# EasyEDA Pro project moss-controller-pcb.eprj, board PCB1
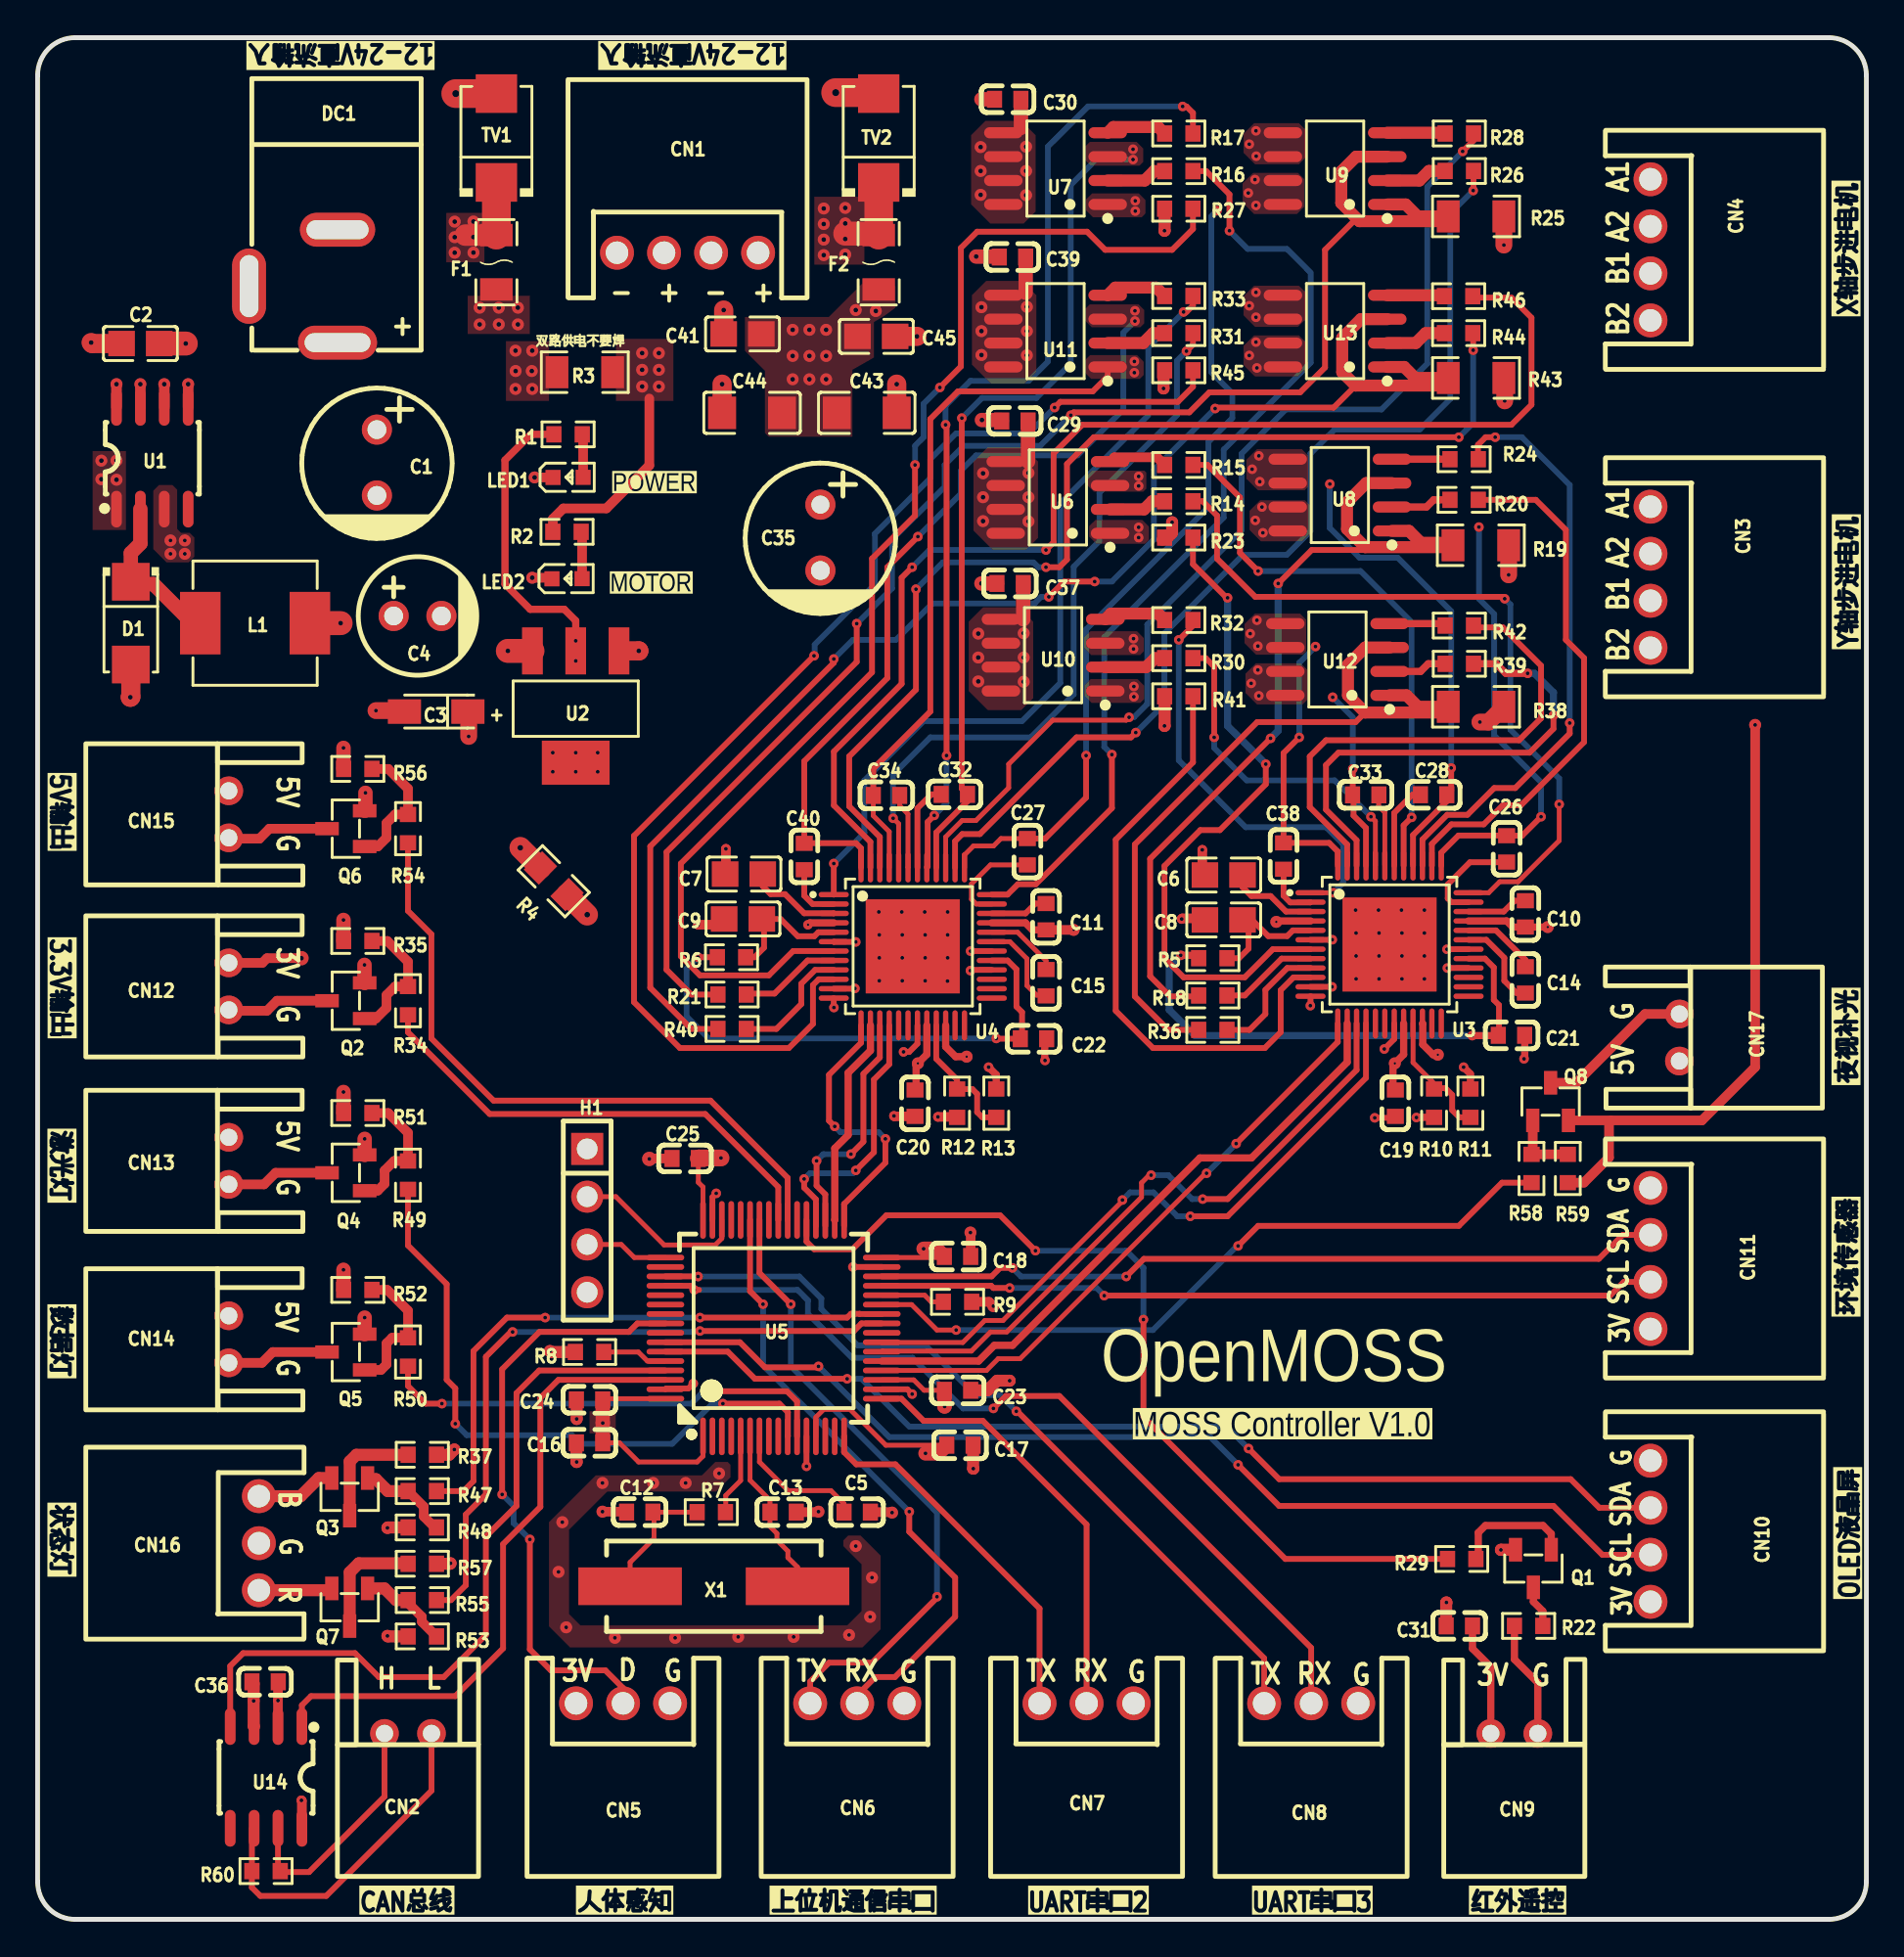
[diagram p2: board, top side]
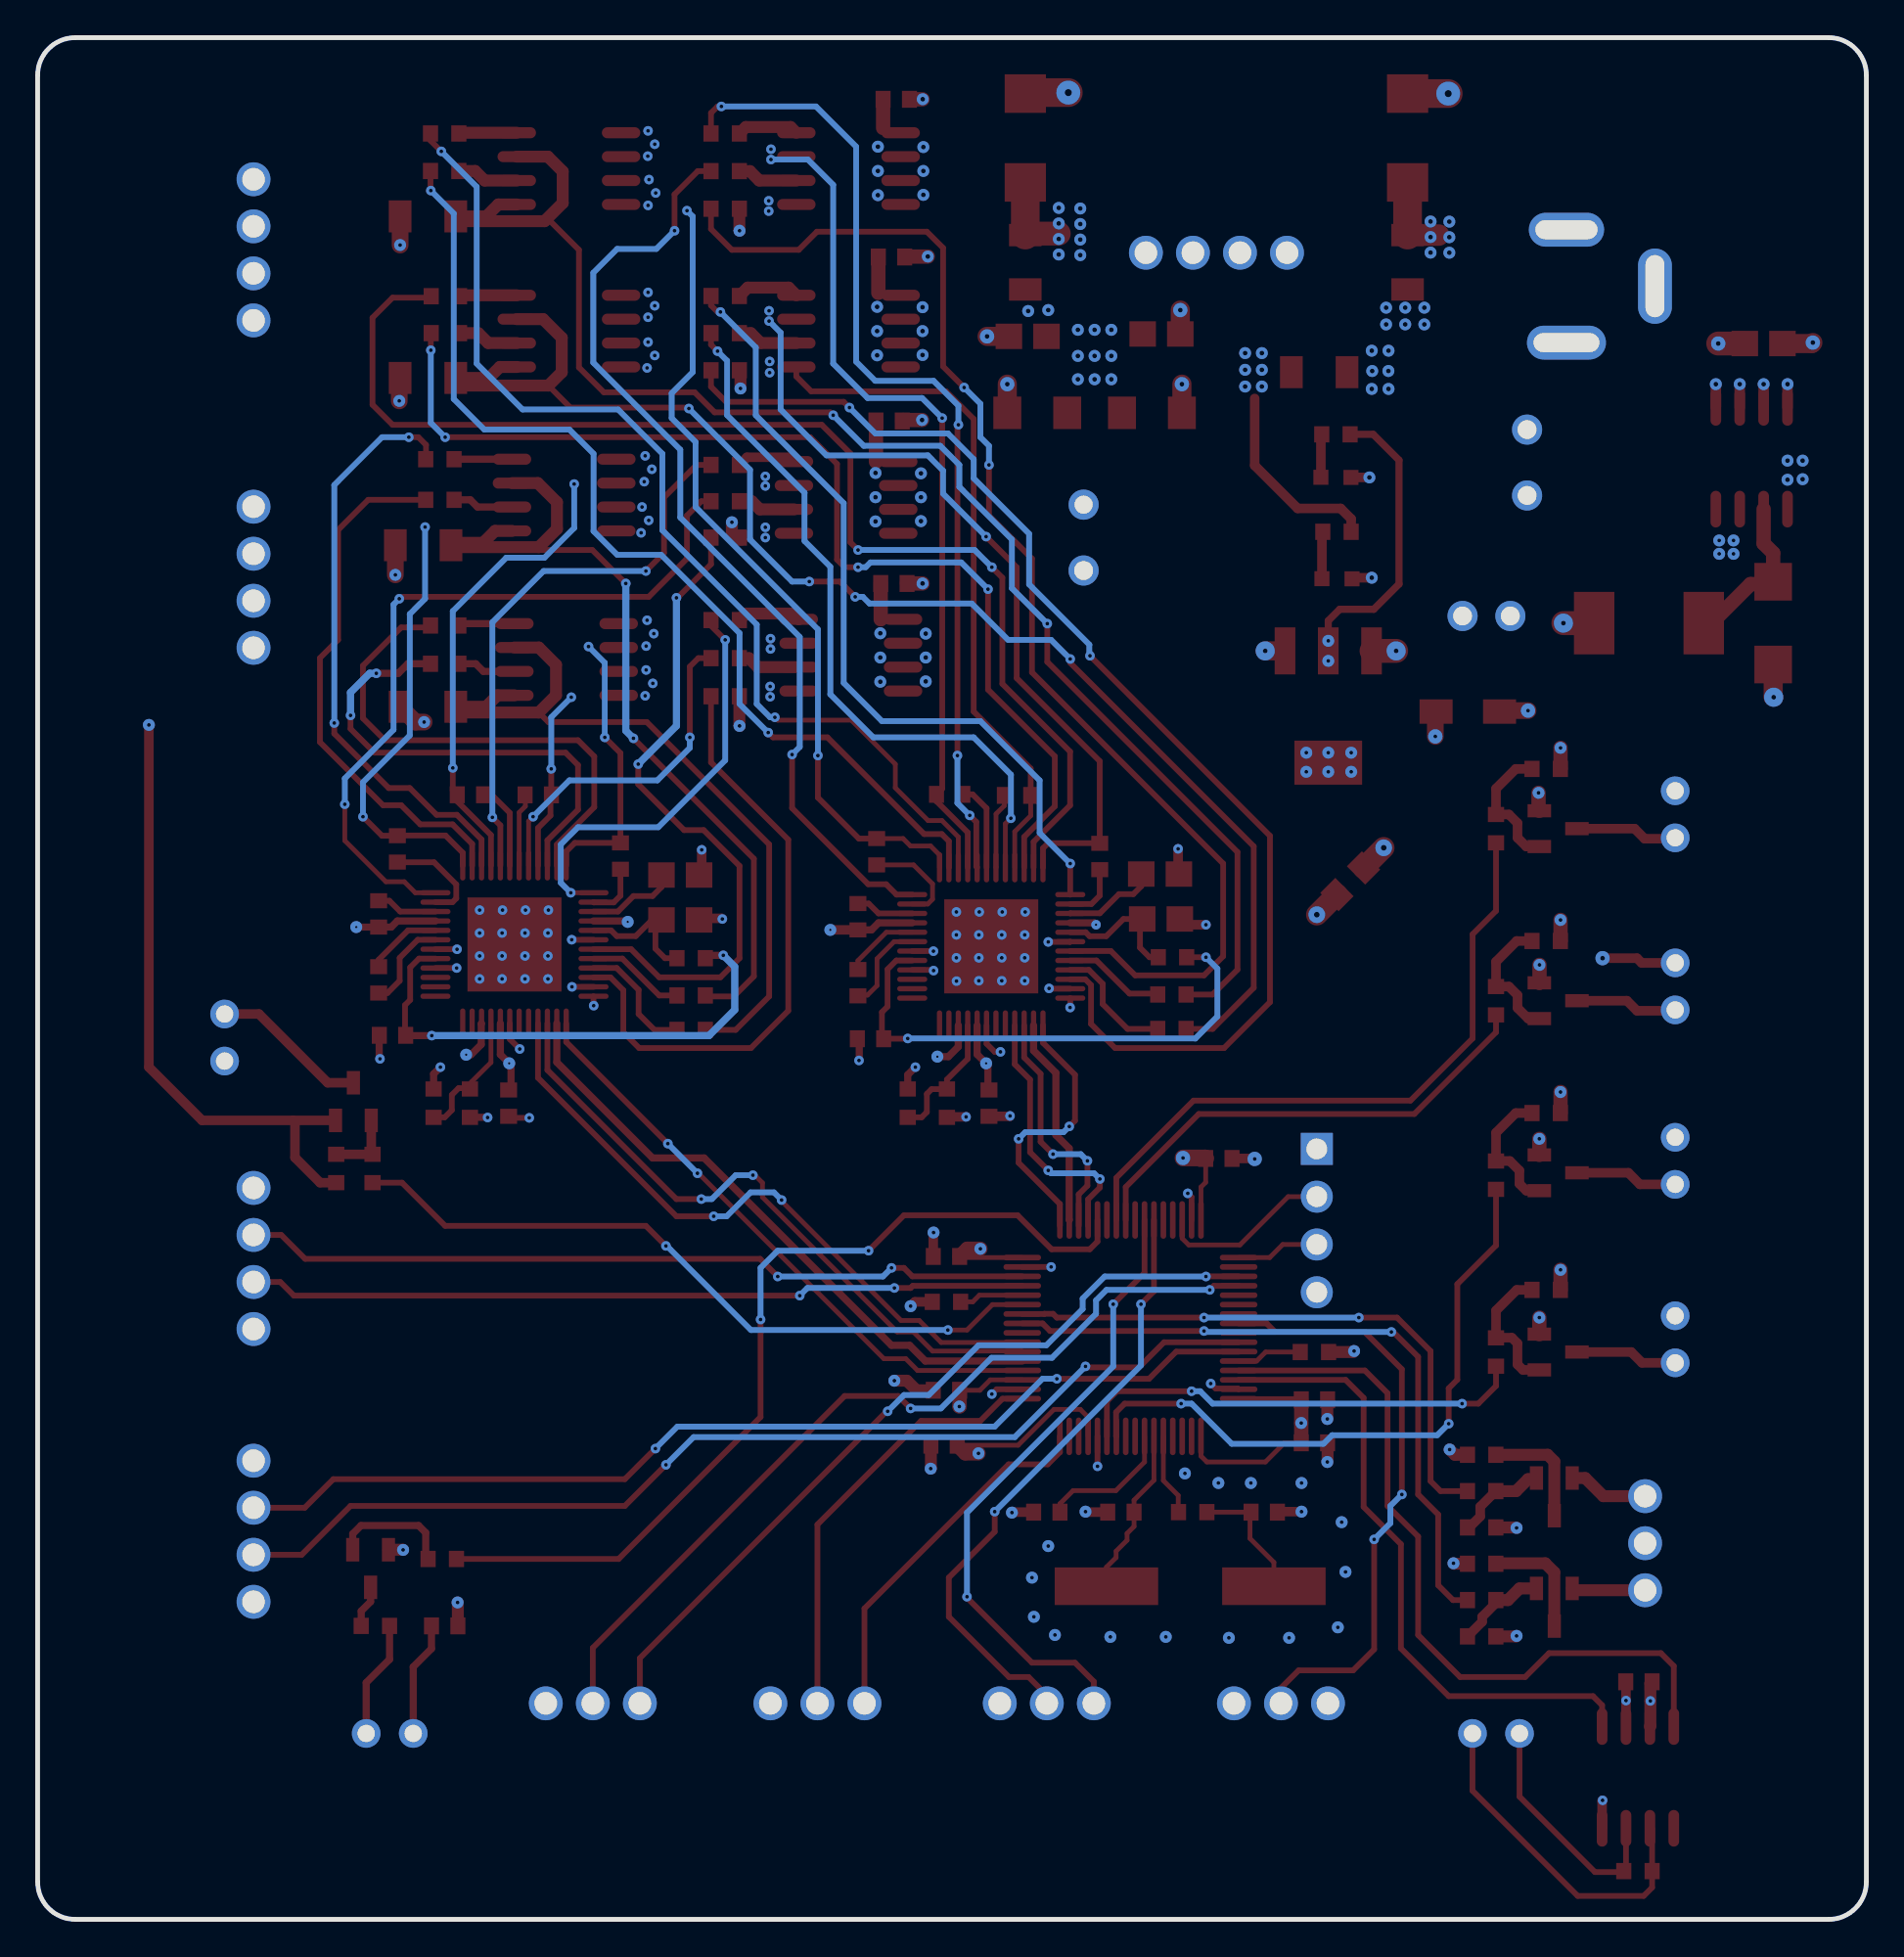
[diagram p3: board, bottom side, seen from below]

Outline 97.2 x 100 mm; copper layers: Top Layer, 电源层, 地层, Bottom Layer. Coordinates in mm from the lower left corner of the outline.
Outline path: 0,98 0,2 arc(0.59,0.59) 2,0 95.2,0 arc(96.61,0.59) 97.2,2 97.2,98 arc(96.61,99.41) 95.2,100 2,100 arc(0.59,99.41) 0,98
Stack: Top Layer 0.035mm / Dielectric1 0.48mm PP er 4.5 / 电源层 0.035mm / Dielectric2 0.48mm FR4 er 4.5 / 地层 0.035mm / Dielectric3 0.48mm PP er 4.5 / Bottom Layer 0.035mm

## Design rules (mm)
template: 用户自定义配置
spacing safeClearance (default): track to track 0.152, other pairs 0.152 to 0.3
track width trackWidth (default): min 0.127, default 0.254, max 2.54
differential pair differentialPair (default): width min 0.127, default 0.254, max 2.54; gap min 0.152, default 0.152
via viaSize (default): diameter min 0.5, default 0.61, max 10; hole min 0.127, default 0.305, max 5.999
net M1_BMA2 uses 全连接
net M1_BMA1 uses 全连接
net M1_BMB2 uses 全连接
net M1_BMB1 uses 全连接
net M2_BMA2 uses 全连接
net M2_BMA1 uses 全连接
net M2_BMB2 uses 全连接
net M2_BMB1 uses 全连接

## Placement (name value [footprint] x y rotation side)
C1  470uF/35V  [CAP-TH_BD8.0-P3.50-D0.6-FD]  18.03 77.42 270 top
C2  1uF  [C0805]  5.46 83.74 0 top
C3  10uF/LowESR  [CAP-SMD_L3.2-W1.6-RD-C7171]  21.18 64.19 180 top
C4  220uF/16V  [CAP-TH_BD6.3-P2.50-D1.0-FD]  20.19 69.27 0 top
C5  100nF  [C0603]  43.56 21.64 0 top
C6  2.2uF  [C0805]  63.04 55.5 180 top
C7  2.2uF  [C0805]  37.54 55.55 180 top
C8  2.2uF  [C0805]  63.04 53.11 180 top
C9  2.2uF  [C0805]  37.49 53.16 180 top
C10  100nF  [C0603]  79.07 53.43 90 top
C11  100nF  [C0603]  53.6 53.28 90 top
C12  22pF  [C0603]  32 21.64 0 top
C13  22pF  [C0603]  39.62 21.64 180 top
C14  22nF  [C0603]  79.07 49.93 90 top
C15  22nF  [C0603]  53.6 49.78 90 top
C16  100nF  [C0603]  29.34 25.32 0 top
C17  100nF  [C0603]  49.02 25.2 180 top
C18  100nF  [C0603]  48.9 35.23 180 top
C19  100nF  [C0603]  72.17 43.38 90 top
C20  100nF  [C0603]  46.63 43.38 90 top
C21  470nF  [C0603]  78.34 46.98 180 top
C22  470nF  [C0603]  52.93 46.8 180 top
C23  100nF  [C0603]  48.9 28.12 180 top
C24  100nF  [C0603]  29.34 27.61 0 top
C25  100nF  [C0603]  34.42 40.44 0 top
C26  220nF  [C0603]  78.08 56.89 270 top
C27  220nF  [C0603]  52.6 56.74 270 top
C28  220nF  [C0603]  74.2 59.76 180 top
C29  470nF  [C0603]  51.94 79.63 0 top
C30  470nF  [C0603]  51.56 96.72 0 top
C31  100nF  [C0603]  75.56 15.6 0 top
C32  220nF  [C0603]  48.72 59.79 180 top
C33  220nF  [C0603]  70.59 59.76 0 top
C34  220nF  [C0603]  45.12 59.73 0 top
C35  220uF  [CAP-TH_BD8.0-P3.50-D0.6-FD-2]  41.6 73.43 270 top
C36  100nF  [C0603]  12.09 12.62 0 top
C37  470nF  [C0603]  51.69 70.99 0 top
C38  220nF  [C0603]  66.22 56.51 270 top
C39  470nF  [C0603]  51.82 88.34 0 top
C40  220nF  [C0603]  40.75 56.48 270 top
C41  100nF  [C0805]  37.47 84.25 0 top
C43  10uF  [C1206]  44.07 80.06 180 top
C44  10uF  [C1206]  37.97 80.06 0 top
C45  100nF  [C0805]  44.58 84.12 180 top
CN1  MOTOR_VIN  [conn-th_a2501wr-4p]  34.54 88.57 180 top
CN2  CAN  [CONN-TH_A2501WRB-2P]  19.69 9.88 0 top
CN3  MOTOR_X  [CONN-TH_A2501WR-4P]  85.72 71.32 90 top
CN4  MOTOR_Y  [CONN-TH_A2501WR-4P]  85.72 88.72 90 top
CN5  BODY_SENSOR  [CONN-TH_A2501WR-3P]  31.12 11.48 0 top
CN6  SERIAL1  [CONN-TH_A2501WR-3P]  43.56 11.48 0 top
CN7  SERIAL2  [CONN-TH_A2501WR-3P]  55.75 11.48 0 top
CN8  SERIAL3  [CONN-TH_A2501WR-3P]  67.69 11.48 0 top
CN9  IR_LIGHT  [CONN-TH_A2501WRB-2P]  78.49 9.88 0 top
CN10  DISPLAY  [CONN-TH_A2501WR-4P]  85.72 20.62 90 top
CN11  AMBIENT_SENSOR  [CONN-TH_A2501WR-4P]  85.72 35.12 90 top
CN12  3V3_OUT  [CONN-TH_A2501WRB-2P]  10.16 49.58 270 top
CN13  LASER_LIGHT  [CONN-TH_A2501WRB-2P]  10.16 40.31 270 top
CN14  DATA_LIGHT  [CONN-TH_A2501WRB-2P]  10.16 30.83 270 top
CN15  5V_OUT  [CONN-TH_A2501WRB-2P]  10.16 58.72 270 top
CN16  STATUS_LIGHT  [CONN-TH_A2501WR-3P]  11.76 19.99 270 top
CN17  850NM_LIGHT  [conn-th_a2501wrb-2p]  87.26 46.86 90 top
D1  SS34  [SMA_L4.3-W2.6-LS5.2-RD]  4.95 68.89 270 top
DC1  DC-005-5A-2.0  [dc-in-th_dc-005-5a-2.0]  13.59 86.79 270 top
F1  0466002.NRHF  [F1206]  24.38 88.06 270 top
F2  0466002.NRHF  [F1206]  44.7 88.06 270 top
H1  DOWNLOAD  [HDR-TH_4P-P2.54-V-F-3]  29.21 37.14 270 top
L1  68uH/2A  [IND-SMD_L7.1-W6.6]  11.56 68.89 0 top
LED1  BLUE_LED  [LED0603-RD]  28.19 76.63 0 top
LED2  BLUE_LED  [LED0603-RD]  28.14 71.25 0 top
Q1  SS8050  [SOT-23-3_L2.9-W1.3-P1.90-LS2.4-BR]  79.5 18.64 90 top
Q2  AO3400A  [SOT-23-3_L2.9-W1.3-P1.90-LS2.4-BR]  16.38 48.82 0 top
Q3  AO3400A  [SOT-23-3_L2.9-W1.3-P1.90-LS2.4-BR]  16.59 22.45 90 top
Q4  AO3400A  [SOT-23-3_L2.9-W1.3-P1.90-LS2.4-BR]  16.38 39.67 0 top
Q5  AO3400A  [SOT-23-3_L2.9-W1.3-P1.90-LS2.4-BR]  16.38 30.15 0 top
Q6  AO3400A  [SOT-23-3_L2.9-W1.3-P1.90-LS2.4-BR]  16.38 57.96 0 top
Q7  AO3400A  [SOT-23-3_L2.9-W1.3-P1.90-LS2.4-BR]  16.59 16.59 90 top
Q8  AO3400A  [SOT-23-3_L2.9-W1.3-P1.90-LS2.4-BR]  80.42 43.46 270 top
R1  1kΩ  [R0603]  28.19 78.92 0 top
R2  10kΩ  [R0603]  28.14 73.74 0 top
R3  0Ω/NC  [R1206]  29.08 82.22 0 top
R4  0Ω  [R0805]  27.43 55.17 315 top
R5  2.2Ω/1%  [R0603]  62.46 51.08 0 top
R6  2.2Ω/1%  [R0603]  36.88 51.13 0 top
R7  390Ω  [R0603]  35.81 21.64 0 top
R8  10kΩ  [R0603]  29.34 30.15 180 top
R9  10kΩ  [R0603]  48.9 32.82 180 top
R10  0Ω  [R0603]  74.22 43.38 90 top
R11  0Ω/NC  [R0603]  76.15 43.38 90 top
R12  0Ω  [R0603]  48.87 43.38 90 top
R13  0Ω/NC  [R0603]  50.95 43.38 90 top
R14  22Ω  [R0603]  60.66 75.36 180 top
R15  22Ω  [R0603]  60.66 77.29 180 top
R16  22Ω  [R0603]  60.66 92.91 180 top
R17  22Ω  [R0603]  60.66 94.91 180 top
R18  47Ω  [R0603]  62.46 49.1 180 top
R19  75mΩ  [R1206]  76.71 73.03 180 top
R20  22Ω  [R0603]  75.82 75.44 180 top
R21  47Ω  [R0603]  36.91 49.15 180 top
R22  4.7Ω  [R0603]  79.25 15.6 180 top
R23  47Ω  [R0603]  60.66 73.43 0 top
R24  22Ω  [R0603]  75.82 77.6 180 top
R25  75mΩ  [R1206]  76.45 90.5 180 top
R26  22Ω  [R0603]  75.56 92.91 180 top
R27  47Ω  [R0603]  60.66 90.91 0 top
R28  22Ω  [R0603]  75.56 94.91 180 top
R29  10kΩ  [R0603]  75.69 19.15 180 top
R30  22Ω  [R0603]  60.66 67.02 180 top
R31  22Ω  [R0603]  60.66 84.3 180 top
R32  22Ω  [R0603]  60.66 69.05 180 top
R33  22Ω  [R0603]  60.66 86.27 180 top
R34  1kΩ  [R0603]  19.69 48.82 90 top
R35  10kΩ  [R0603]  17.02 51.99 0 top
R36  47Ω  [R0603]  62.46 47.27 180 top
R37  47Ω  [R0603]  20.45 24.69 0 top
R38  75mΩ  [R1206]  76.45 64.44 180 top
R39  22Ω  [R0603]  75.56 66.73 180 top
R40  47Ω  [R0603]  36.91 47.32 180 top
R41  47Ω  [R0603]  60.66 65 0 top
R42  22Ω  [R0603]  75.56 68.76 180 top
R43  75mΩ  [R1206]  76.45 81.92 180 top
R44  22Ω  [R0603]  75.53 84.3 180 top
R45  47Ω  [R0603]  60.66 82.32 0 top
R46  22Ω  [R0603]  75.53 86.26 180 top
R47  1kΩ  [R0603]  20.45 22.76 180 top
R48  10kΩ  [R0603]  20.45 20.83 0 top
R49  1kΩ  [R0603]  19.69 39.55 90 top
R50  1kΩ  [R0603]  19.69 30.15 90 top
R51  10kΩ  [R0603]  17.02 42.85 0 top
R52  10kΩ  [R0603]  17.02 33.45 0 top
R53  10kΩ  [R0603]  20.45 15.04 180 top
R54  1kΩ  [R0603]  19.69 57.96 90 top
R55  1kΩ  [R0603]  20.45 16.97 180 top
R56  10kΩ  [R0603]  17.02 61.14 0 top
R57  47Ω  [R0603]  20.45 18.9 180 top
R58  1kΩ  [R0603]  79.4 39.9 90 top
R59  10kΩ  [R0603]  81.33 39.9 90 top
R60  120Ω  [R0603]  12.14 2.57 0 top
TV1  SMBJ24A  [SMB_L4.6-W3.6-LS5.3-RD]  24.38 94.67 90 top
TV2  SMBJ24A  [SMB_L4.6-W3.6-LS5.3-RD]  44.7 94.67 90 top
U1  XL1509-5.0E1  [SOIC-8_L5.0-W4.0-P1.27-LS6.0-BL]  6.1 77.65 0 top
U2  AMS1117-3.3  [SOT-223-3_L6.5-W3.4-P2.30-LS7.0-BR]  28.6 64.44 90 top
U3  TMC5160A-TA-T  [TQFP-48_L7.0-W7.0-P0.50-LS9.0-BL-EP]  71.85 51.81 270 top
U4  TMC5160A-TA-T  [TQFP-48_L7.0-W7.0-P0.50-LS9.0-BL-EP]  46.51 51.71 270 top
U5  STM32F103RBT6  [LQFP-64_L10.0-W10.0-P0.50-LS12.0-BL]  39.12 31.42 0 top
U6  AO4882  [SOIC-8_L4.9-W3.9-P1.27-LS6.0-BL]  54.23 75.56 90 top
U7  AO4882  [SOIC-8_L4.9-W3.9-P1.27-LS6.0-BL]  54.1 93.04 90 top
U8  AO4882  [SOIC-8_L4.9-W3.9-P1.27-LS6.0-BL]  69.22 75.69 90 top
U9  AO4882  [SOIC-8_L4.9-W3.9-P1.27-LS6.0-BL]  68.96 93.04 90 top
U10  AO4882  [SOIC-8_L4.9-W3.9-P1.27-LS6.0-BL]  53.97 67.18 90 top
U11  AO4882  [SOIC-8_L4.9-W3.9-P1.27-LS6.0-BL]  54.1 84.4 90 top
U12  AO4882  [SOIC-8_L4.9-W3.9-P1.27-LS6.0-BL]  69.09 66.95 90 top
U13  AO4882  [SOIC-8_L4.9-W3.9-P1.27-LS6.0-BL]  68.96 84.4 90 top
U14  TJA1050T/CM,118  [SOIC-8_L5.0-W4.0-P1.27-LS6.0-BL]  12.14 7.54 180 top
X1  8MHz  [CRYSTAL-SMD_L11.5-W4.8-LS12.7]  35.94 17.7 180 top

## Footprints (pads in the part's own frame, mm; a bottom-side part is the same pattern mirrored in y, then rotated)
C0603
  rect 0.8x0.9 smd: 1(-0.7,0) 2(0.7,0)
C0805
  rect 1.41x1.35 smd: 1(-1,0) 2(1,0)
C1206
  rect 1.485x1.728 smd: 1(-1.593,0) 2(1.593,0)
CAP-SMD_L3.2-W1.6-RD-C7171
  rect 1.758x1.296 smd: 1(-1.687,0) 2(1.687,0)
CAP-TH_BD6.3-P2.50-D1.0-FD
  round 1.6 hole 1: 1(-1.27,0) 2(1.27,0)
CAP-TH_BD8.0-P3.50-D0.6-FD
  round 1.6 hole 1: 1(-1.75,0) 2(1.75,0)
CAP-TH_BD8.0-P3.50-D0.6-FD-2
  round 1.6 hole 0.96: 1(-1.75,0)
  round 1.6 hole 1: 2(1.75,0)
CONN-TH_A2501WR-3P
  round 1.8 hole 1.2: 1(-2.5,0) 2(0,0) 3(2.5,0)
conn-th_a2501wr-4p
  round 1.8 hole 1.2: 1(-3.75,0) 2(-1.25,0) 3(1.25,0) 4(3.75,0)
CONN-TH_A2501WR-4P
  round 1.8 hole 1.2: 1(-3.75,0) 2(-1.25,0) 3(1.25,0) 4(3.75,0)
CONN-TH_A2501WRB-2P
  round 1.524 hole 0.914: 1(-1.25,0) 2(1.25,0)
conn-th_a2501wrb-2p
  round 1.524 hole 0.914: 1(-1.25,0) 2(1.25,0)
CRYSTAL-SMD_L11.5-W4.8-LS12.7
  rect 5.5x2 smd: 1(-4.45,0) 2(4.45,0)
dc-in-th_dc-005-5a-2.0
  oval 1.8x4.2 hole 1x3.5: 1(3,2.352)
  oval 1.8x4 hole 1x3.3: 2(-3,2.352)
  oval 4x1.8 hole 3.3x1: 3(-0.001,-2.352)
F1206
  rect 1.19x1.728 smd: 1(-1.445,0) 2(1.445,0)
HDR-TH_4P-P2.54-V-F-3
  rect 1.7x1.7 hole 1.1: 1(-3.81,0)
  round 1.7 hole 1.1: 2(-1.27,0) 3(1.27,0) 4(3.81,0)
IND-SMD_L7.1-W6.6
  rect 2.15x3.32 smd: 1(-2.913,0) 2(2.913,0)
LED0603-RD
  rect 0.8x0.8 smd: 1(-0.799,-0.004) 2(0.799,0.004)
LQFP-64_L10.0-W10.0-P0.50-LS12.0-BL
  oval 0.3x2 smd: 1(-3.75,-5.75) 2(-3.25,-5.75) 3(-2.75,-5.75) 4(-2.25,-5.75) 5(-1.75,-5.75) 6(-1.25,-5.75) 7(-0.75,-5.75) 8(-0.25,-5.75) 9(0.25,-5.75) 10(0.75,-5.75) 11(1.25,-5.75) 12(1.75,-5.75) 13(2.25,-5.75) 14(2.75,-5.75) 15(3.25,-5.75) 16(3.75,-5.75) 33(3.75,5.75) 34(3.25,5.75) 35(2.75,5.75) 36(2.25,5.75) 37(1.75,5.75) 38(1.25,5.75) 39(0.75,5.75) 40(0.25,5.75) 41(-0.25,5.75) 42(-0.75,5.75) 43(-1.25,5.75) 44(-1.75,5.75) 45(-2.25,5.75) 46(-2.75,5.75) 47(-3.25,5.75) 48(-3.75,5.75)
  oval 2x0.3 smd: 17(5.75,-3.75) 18(5.75,-3.25) 19(5.75,-2.75) 20(5.75,-2.25) 21(5.75,-1.75) 22(5.75,-1.25) 23(5.75,-0.75) 24(5.75,-0.25) 25(5.75,0.25) 26(5.75,0.75) 27(5.75,1.25) 28(5.75,1.75) 29(5.75,2.25) 30(5.75,2.75) 31(5.75,3.25) 32(5.75,3.75) 49(-5.75,3.75) 50(-5.75,3.25) 51(-5.75,2.75) 52(-5.75,2.25) 53(-5.75,1.75) 54(-5.75,1.25) 55(-5.75,0.75) 56(-5.75,0.25) 57(-5.75,-0.25) 58(-5.75,-0.75) 59(-5.75,-1.25) 60(-5.75,-1.75) 61(-5.75,-2.25) 62(-5.75,-2.75) 63(-5.75,-3.25) 64(-5.75,-3.75)
R0603
  rect 0.806x0.864 smd: 1(-0.753,0) 2(0.753,0)
R0805
  rect 1.133x1.377 smd: 1(-1,0) 2(1,0)
R1206
  rect 1.208x1.701 smd: 1(-1.479,0) 2(1.479,0)
SMA_L4.3-W2.6-LS5.2-RD
  rect 2x2 smd: 1(-2.2,0) 2(2.2,0)
SMB_L4.6-W3.6-LS5.3-RD
  rect 2.047x2.192 smd: 1(-2.361,0) 2(2.361,0)
SOIC-8_L4.9-W3.9-P1.27-LS6.0-BL
  oval 0.588x2.045 smd: 1(-1.905,-2.772) 2(-0.635,-2.772) 3(0.635,-2.772) 4(1.905,-2.772) 5(1.905,2.772) 6(0.635,2.772) 7(-0.635,2.772) 8(-1.905,2.772)
SOIC-8_L5.0-W4.0-P1.27-LS6.0-BL
  oval 0.569x1.95 smd: 1(-1.905,-2.705) 2(-0.635,-2.705) 3(0.635,-2.705) 4(1.905,-2.705) 5(1.905,2.705) 6(0.635,2.705) 7(-0.635,2.705) 8(-1.905,2.705)
SOT-23-3_L2.9-W1.3-P1.90-LS2.4-BR
  rect 1.25x0.7 smd: 1(1,-0.95) 2(1,0.95) 3(-1,0)
SOT-223-3_L6.5-W3.4-P2.30-LS7.0-BR
  rect 2.5x1.1 smd: 1(2.97,-2.3) 2(2.97,0) 3(2.97,2.3)
  rect 2.34x3.6 smd: 4(-2.97,0)
TQFP-48_L7.0-W7.0-P0.50-LS9.0-BL-EP
  oval 0.28x1.6 smd: 1(-2.75,-4.2) 2(-2.25,-4.2) 3(-1.75,-4.2) 4(-1.25,-4.2) 5(-0.75,-4.2) 6(-0.25,-4.2) 7(0.25,-4.2) 8(0.75,-4.2) 9(1.25,-4.2) 10(1.75,-4.2) 11(2.25,-4.2) 12(2.75,-4.2) 25(2.75,4.2) 26(2.25,4.2) 27(1.75,4.2) 28(1.25,4.2) 29(0.75,4.2) 30(0.25,4.2) 31(-0.25,4.2) 32(-0.75,4.2) 33(-1.25,4.2) 34(-1.75,4.2) 35(-2.25,4.2) 36(-2.75,4.2)
  oval 1.6x0.28 smd: 13(4.2,-2.75) 14(4.2,-2.25) 15(4.2,-1.75) 16(4.2,-1.25) 17(4.2,-0.75) 18(4.2,-0.25) 19(4.2,0.25) 20(4.2,0.75) 21(4.2,1.25) 22(4.2,1.75) 23(4.2,2.25) 24(4.2,2.75) 37(-4.2,2.75) 38(-4.2,2.25) 39(-4.2,1.75) 40(-4.2,1.25) 41(-4.2,0.75) 42(-4.2,0.25) 43(-4.2,-0.25) 44(-4.2,-0.75) 45(-4.2,-1.25) 46(-4.2,-1.75) 47(-4.2,-2.25) 48(-4.2,-2.75)
  rect 5x5 smd: 49(0,0)

## Nets
As in the schematic, except:
$1N56880: Q4.1 R49.2 R51.2

Pads without a net: U1 4; U3 17 18 23 24 25 26 27; U4 17 18 23 24 25 26 27; U5 2 3 4 8 9 14 15 24 38 41 44 45 50 53 54 55 57; U14 5

## Via types
v1: diameter 0.635, hole 0.254, Top Layer to Bottom Layer, 81 vias
v2: diameter 0.762, hole 0.254, Top Layer to Bottom Layer, 7 vias
v3: diameter 0.635, hole 0.127, Top Layer to Bottom Layer, 7 vias
v4: diameter 0.635, hole 0.203, Top Layer to Bottom Layer, 64 vias
v5: diameter 1.016, hole 0.254, Top Layer to Bottom Layer, 4 vias
v6: diameter 0.508, hole 0.203, Top Layer to Bottom Layer, 208 vias
v7: diameter 0.762, hole 0.203, Top Layer to Bottom Layer, 4 vias
v8: diameter 0.889, hole 0.305, Top Layer to Bottom Layer, 2 vias
v9: diameter 1.27, hole 0.381, Top Layer to Bottom Layer, 2 vias
v10: diameter 0.508, hole 0.127, Top Layer to Bottom Layer, 1 via

## Routing (per net, layer and track width the routed paths; a pad name or vN(x,y) marks a point on that pad's centre or on a via; arc(x,y) is an arc through that point)
3V3: length 64.3
  Top Layer w0.254: U5.48 35.37,38.92 35.12,39.17 C25.2 ; U5.19 46.56,28.67 47.12,28.12 C23.2 ; C16.2 30.93,25.32 31.94,24.31 35.05,24.31 35.37,24.62 U5.1 ; U5.13 41.37,26.69 41.78,27.1 43.18,27.1 45.09,25.2 C17.2 ; C18.2 48.13,35.17 U5.32 ; C24.2 30.1,27.67 U5.64
  Top Layer w0.381: C31.2 76.26,14.39 77.24,13.42 77.24,10.69 ; v4(28.6,67.94) 28.6,69.01 27.99,69.62 26.18,69.62 24.84,70.96 24.84,77.55 26.21,78.92 R1.1
  Top Layer w0.508: CN12.1 11.94,50.83 12.19,51.08 v2(14.02,51.08)
  Top Layer w0.635: R57.1 21.92,18.9 v4(21.95,18.92) ; v4(22.15,24.97) 21.87,24.69 R37.2
  Top Layer w0.762: C24.2 v4(30.04,26.38) C16.2 ; v4(48.21,27.25) 48.19,27.27 C23.2 ; C18.2 47.79,35.64 v4(47.09,35.64) ; C17.2 47.89,24.76 v4(47.19,24.76)
  Top Layer w0.889: C25.2 35.14,40.46 v7(36.32,40.46) ; v7(22.91,62.86) 22.91,64.14 C3.1
  vias: v4(27.38,62) v4(27.38,60.99) v4(28.6,66.88) v4(28.6,62) v4(28.6,60.99) v4(29.77,62) v4(29.77,60.99)
3V3_OUT: length 25.8
  Top Layer w0.305: R34.1 19.69,47.14 24.03,42.8 35.48,42.8 39.37,38.92 U5.40
5V: length 20.1
  Top Layer w0.381: v3(74.42,45.95) 74.17,45.95 73.62,46.49 73.62,47.59 U3.22 ; C20.2 46.63,44.13 46.69,44.19 46.69,45.4 v3(46.79,45.49) 47.26,45.97 U4.20 ; v3(49.38,45.85) 48.79,45.85 48.26,46.37 U4.22 ; R11.2 76.15,44.93 v6(75.79,45.29) ; v6(50.55,45.29) 50.95,44.88 R13.2 ; U3.20 72.6,45.96 v3(72.14,45.49) 72.04,45.39 72.04,44.08
  Top Layer w0.635: C36.1 11.48,12.53 v6(11.48,11.61) 11.48,10.27 11.51,10.25
  Top Layer w1.27: L1.2 v5(16.1,68.89) ; U2.3 v5(24.99,67.41)
  vias: v4(7.06,73.28) v4(7.06,72.57) v4(7.82,73.28) v4(7.82,72.57)
5V_OUT: length 35.2
  Top Layer w0.305: R54.1 19.69,53.59 20.93,52.35 20.93,46.81 24.23,43.51 35.76,43.51 39.87,39.41 U5.39
DGND: length 55
  Top Layer w0.305: v6(46.03,46.1) 46.33,46.1 46.76,46.54 U4.19 ; v6(68.81,52.06) 68.81,52.06 U3.6 ; v6(46.48,27.91) 46.23,28.17 U5.18 ; U3.30 74.91,51.56 v6(74.91,51.55) ; 44.86,34.67 v6(43.33,34.67) ; v6(34.85,28.47) 34.59,28.21 33.41,28.21 U5.63 ; v6(49.59,51.45) 49.59,51.46 U4.30 ; U3.28 v6(74.93,50.56) 74.91,50.54 ; U3.12 67.66,48.57 v6(67.64,48.56) ; 68.81,49.57 v6(68.8,49.56) U3.11 ; v6(49.58,50.42) 49.62,50.46 U4.28 ; U4.11 43.43,49.46 v6(43.44,49.47) ; U4.6 42.33,51.94 v6(43.49,51.94) ; v6(42.32,48.46) 42.31,48.47 U4.12 ; U5.12 v6(40.87,24.08) 40.84,24.05 ; v6(71.58,46.25) 72.1,46.78 U3.19 ; C19.1 72.09,42.6 v6(71.07,42.6) ; U5.47 35.87,38.38 v6(36.07,38.58)
  Top Layer w0.381: v6(73.28,42.61) 73.29,42.62 R10.1 ; 79.04,46.98 79.04,45.77 v6(79,45.73) ; 53.53,46.8 53.53,45.66 v6(53.54,45.64)
  Top Layer w0.508: C18.1 49.59,36.49 v4(49.58,36.5) ; v6(35.1,52.86) 36.16,52.86 36.18,52.84 ; v6(47.85,42.65) 48.84,42.65 R12.1 ; v4(30.02,21.67) 31.28,21.67 C12.1 ; v7(32.51,40.41) 32.54,40.44 C25.1 ; 61.9,55.5 v6(61.9,56.84) ; v4(50.8,32.59) 50.57,32.82 R9.1 ; v4(45.41,21.62) 45.39,21.64 C5.2 ; 12.78,10.25 v6(12.78,11.63) 12.78,12.61 C36.2 ; v4(41.5,21.67) 41.48,21.64 C13.1 ; 36.58,55.55 v6(36.58,56.89) ; 61.96,53.2 60.84,53.2 v6(60.81,53.16) ; U14.8 14.05,6.3 v6(14.02,6.32) ; v6(45.52,42.7) 45.54,42.67 C20.1
  Top Layer w0.635: v4(49.73,23.95) 49.72,23.96 C17.1 ; v4(28.65,24.31) 28.64,24.32 C16.1 ; v4(28.65,26.59) 28.65,27.6 C24.1 ; C31.1 74.87,16.83 v4(74.88,16.84) ; C23.1 50.49,28.12 51,28.63 v4(51.66,28.63) ; Q1.2 77.78,19.64 v4(77.78,19.63) ; R8.2 27.28,30.15 v4(27.23,30.2)
  Top Layer w1.143: R4.2 v8(29.21,53.39)
  vias: v4(27.69,18.47) v4(27.89,21.11) v4(28.09,15.52) v4(30.02,23.19) v4(30.68,14.96) v4(32.72,23.19) v4(33.88,14.96) v4(34.44,23.19) v4(36.22,23.7) v4(37.24,15.01) v4(40.18,15.01) v4(43.13,15.11) v4(43.49,19.84) v4(44.25,16.08) v4(44.35,18.16) v6(44.71,53.54) v6(44.74,52.32) v6(44.74,51.1) v6(44.74,49.88) v6(45.93,53.54) v6(45.96,52.32) v6(45.96,51.1) v6(45.96,49.88) v6(47.15,53.54) v6(47.17,52.32) v6(47.17,51.1) v6(47.17,49.88) v6(48.37,53.54) v6(48.37,52.32) v6(48.37,51.1) v6(48.36,49.86) v6(70.05,53.64) v6(70.08,52.42) v6(70.08,51.2) v6(70.08,49.98) v6(71.27,53.64) v6(71.3,52.42) v6(71.3,51.2) v6(71.3,49.98) v6(72.49,53.64) v6(72.51,52.42) v6(72.51,51.2) v6(72.51,49.98) v6(73.71,53.64) v6(73.71,52.42) v6(73.71,51.2) v6(73.71,49.98)
PGND: length 83.5
  Top Layer w0.508: v1(26.29,71.3) 27.28,71.3 LED2.1 ; LED1.1 v1(26.42,76.63) ; 83.62,42.46 88.46,42.46 91.29,45.29 v4(91.29,63.47) ; 83.62,42.46 83.52,42.36 83.52,40.49 82.19,39.15 R59.1 ; 83.62,42.46 Q8.2
  Top Layer w0.559: v1(8,81.58) U1.5 ; v1(5.46,81.58) U1.7 ; v1(6.73,81.58) U1.6 ; v1(4.19,81.58) U1.8
  Top Layer w0.635: R45.1 59.84,82.26 v4(59.84,81.36) ; v4(18.59,20.8) 18.62,20.83 R48.1 ; R53.2 18.62,15.04 v4(18.59,15.06) ; 59.89,64.99 R41.1 59.9,63.43 v4(59.89,63.42) ; 59.79,73.32 R23.1 60.05,73.43 60.3,73.69 v4(60.3,74.24) ; R27.1 59.9,89.75 v4(59.89,89.74)
  Top Layer w0.762: v1(50.19,79.68) 51.19,79.68 C29.1 ; R35.1 16.26,52 v4(16.26,53.11) ; v4(17.42,59.87) 17.42,58.95 Q6.2 ; C39.1 51.09,88.37 v1(49.89,88.37) ; C30.1 50.16,96.72 ; R51.1 16.26,42.86 v4(16.26,43.97) ; C37.1 v1(50.16,70.99) ; v4(16.26,34.52) 16.26,33.46 R52.1 ; v4(16.26,62.26) 16.26,61.15 R56.1 ; v4(17.37,50.72) 17.37,49.78 Q2.2 ; Q4.2 v4(17.38,41.48) ; Q5.2 v4(17.38,31.98)
  Top Layer w0.889: v7(17.98,64.24) 19.45,64.24 19.5,64.19 ; v4(77.98,80.7) 77.98,81.36 77.93,81.41 77.93,81.92 ; 77.93,64.44 77.12,63.63 v4(76.66,63.63) ; R19.1 v4(78.19,71.45) ; 77.93,90.5 v4(77.93,88.98)
  Top Layer w1.016: v5(4.93,64.95) 4.95,64.97 D1.2 ; C43.1 v2(45.66,81.58) ; v2(2.84,83.8) 2.9,83.74 C2.1 ; U2.1 v5(31.95,67.41) ; C41.1 v2(36.47,85.52) ; C44.1 v2(36.38,81.58) ; C45.1 v2(46.74,84.12)
  Top Layer w1.143: R4.1 v8(25.65,56.95)
  Top Layer w1.524: v9(42.42,97.08) 44.65,97.08 TV2.2 ; TV1.2 v9(22.22,97.03)
  vias: v1(50.16,96.73)
VIN: length 1.4
  Top Layer w1.27: C2.2 v2(7.87,83.74)
  vias: v1(3.39,77.52) v1(3.39,76.53) v1(4.19,77.52) v1(4.19,76.5) v1(23.5,85.65) v1(23.5,84.76) v1(24.51,85.65) v1(24.51,84.76) v1(25.4,83.36) v1(25.41,82.28) v1(25.4,81.33) v1(25.53,85.65) v1(25.53,84.76) v1(26.29,83.36) v1(26.27,82.28) v1(26.29,81.33)
850NM_LIGHT: length 38.3
  Top Layer w0.254: v6(48.82,31.32) 47.8,31.32 46.45,32.67 U5.27
  Top Layer w0.305: R58.1 77.83,39.15 75.54,36.86 64.87,36.86 v6(63.81,35.79)
  Bottom Layer w0.305: v6(48.82,31.32) 59.28,31.32 63.75,35.79 v6(63.81,35.79)
BODY_SENSOR: length 31.8
  Top Layer w0.305: v6(26.16,20.19) 26.16,14.35 27.28,13.23 30.18,13.23 31.12,12.29 CN5.2 ; U5.56 31.88,31.67 31.42,31.22 26.67,31.22 24.69,29.24 v6(24.69,22.58)
  Bottom Layer w0.305: v6(24.69,22.58) 25.3,21.97 25.3,21.06 v6(26.16,20.19)
BOOT0: length 3.5
  Top Layer w0.254: R8.1 31.93,30.15 32.41,29.67 U5.60
BOOT1: length 3.4
  Top Layer w0.254: U5.28 47.15,33.17 47.5,32.82 R9.2
CAN_RX: length 40.5
  Top Layer w0.305: 10.24,10.25 10.24,13.46 10.92,14.15 16.87,14.15 18.14,12.88 21.59,12.88 23.83,15.11 23.83,20.35 25.45,21.97 25.45,27.97 26.66,29.17 U5.61
CAN_TX: length 34.2
  Top Layer w0.305: 14.05,10.25 14.05,11.38 14.53,11.86 22.2,11.86 24.74,14.4 24.74,19.94 26.72,21.92 26.72,27.71 27.68,28.67 U5.62
DATA_LIGHT: length 24.5
  Top Layer w0.305: U5.11 40.37,27.53 39.83,28.07 v6(35.87,28.07) ; R50.1 19.69,28.35 20.62,27.41 v6(21.49,27.41)
  Bottom Layer w0.305: v6(21.49,27.41) 34.75,27.41 35.41,28.07 v6(35.87,28.07)
I2C1_SCL: length 57.1
  Top Layer w0.305: v6(41.5,29.39) 41.45,29.34 38.66,29.34 37.33,30.67 U5.58 ; CN10.2 83.16,19.38 80.57,21.97 65.99,21.97 v6(63.81,24.16)
  Bottom Layer w0.305: v6(41.5,29.39) 45.26,25.63 62.33,25.63 v6(63.81,24.16)
I2C1_SDA: length 55.8
  Top Layer w0.305: v6(64.36,25.02) 65.99,23.39 81.48,23.39 83,21.88 CN10.3 ; U5.59 36.68,30.17 38.13,28.73 v6(43.03,28.73)
  Bottom Layer w0.305: v6(64.36,25.02) 63.19,26.19 46.33,26.19 43.79,28.73 v6(43.03,28.73)
I2C2_SCL: length 41.4
  Top Layer w0.305: U5.29 50.68,33.67 50.8,33.55 v6(51.66,33.55) ; v6(56.69,33.15) 83.58,33.15 84.3,33.87 CN11.2
  Bottom Layer w0.305: v6(56.69,33.15) 56.29,33.55 v6(51.66,33.55)
I2C2_SDA: length 42.2
  Top Layer w0.305: v6(57.86,34.16) 58.8,35.1 82.98,35.1 84.25,36.37 CN11.3 ; v6(51.82,34.62) 51.16,34.62 50.71,34.17 U5.30
  Bottom Layer w0.305: v6(51.82,34.62) 52.27,34.16 v6(57.86,34.16)
IR_38KHZ: length 48.3
  Top Layer w0.305: U5.37 40.87,36.02 41.28,35.61 43.31,35.61 45.11,37.41 51.16,37.41 v6(53.03,35.53) ; v6(58.78,31.88) 58.78,26.7 66.32,19.15 R29.2
  Bottom Layer w0.305: v6(58.78,31.88) 58.78,34.62 57.86,35.53 v6(53.03,35.53)
LASER_LIGHT: length 34
  Top Layer w0.305: R49.1 19.69,35.81 21.74,33.76 21.74,28.68 22.2,28.22 v6(22.2,26.34) ; U5.10 39.88,25.68 39.88,26.95 39.42,27.41 v6(36.42,27.41)
  Bottom Layer w0.305: v6(36.42,27.41) 35.87,27.41 33.73,25.27 28.85,25.27 28.4,25.73 22.81,25.73 v6(22.2,26.34)
M1_5VOUT: length 7.1
  Top Layer w0.305: U3.5 66.72,52.56 66.42,52.25 65.41,52.25 64.55,53.11 C8.1 64.36,52.79 64.36,51.59 63.86,51.08 R5.2
M1_BMA1: length 25
  Top Layer w0.305: v6(75.13,61.19) 75.13,60 C28.1 74.9,59.42 73.1,57.62 U3.40
  Bottom Layer w0.305: v6(75.13,61.19) 75.13,69.52 72.29,72.36 70.26,72.36 68.68,73.94 v6(68.68,76.28)
  vias: v6(58.52,76.68) v6(58.52,76.17) v6(64.55,77.06) v6(64.91,77.78) v6(64.96,76.4)
M1_BMA2: length 23.5
  Top Layer w0.305: v6(79.91,58.6) 78.9,57.59 C26.1 78.07,57.6 75.52,57.6 74.6,56.69 U3.37
  Bottom Layer w0.305: v6(79.91,58.6) 79.91,60.43 77.42,62.92 77.42,69.37 76.61,70.18 v6(76.61,73.99)
  vias: v6(58.52,73.98) v6(58.52,73.43) v6(64.72,74.35) v6(65.07,75.06) v6(65.13,73.69)
M1_BMB1: length 15
  Top Layer w0.305: v6(67.06,62.81) 66.22,61.98 66.22,57.21 68.65,57.21 69.1,56.75 U3.48
  Bottom Layer w0.305: v6(67.92,67.64) 67.06,66.78 v6(67.06,62.81)
  vias: v6(58.25,68.06) v6(58.25,67.51) v6(64.45,68.33) v6(64.81,69.04) v6(64.86,67.67)
M1_BMB2: length 9.7
  Top Layer w0.305: U3.45 70.6,58 69.94,58.66 69.94,59.76 ; v6(69.9,61.14) 69.9,59.77 C33.1
  Bottom Layer w0.305: v6(68.83,64.95) 69.9,63.88 v6(69.9,61.14)
  vias: v6(58.27,65.52) v6(58.27,64.97) v6(64.5,65.68) v6(64.86,66.4) v6(64.91,65.02)
M1_CA1: length 4.6
  Top Layer w0.305: U3.42 72.1,58.8 73.07,59.76 C28.2
M1_CA2: length 5.6
  Top Layer w0.305: C26.2 78.07,56.18 76.13,56.18 74.95,55 74.95,54.26 75.15,54.06 U3.35
M1_CB1: length 3
  Top Layer w0.305: U3.2 67.64,54.04 66.58,54.04 66.22,54.4 C38.2
M1_CB2: length 3.9
  Top Layer w0.254: 71.34,59.76 71.28,59.69 71.28,59.15 71.6,58.82 U3.43
M1_HA1: length 29.9
  Top Layer w0.305: v6(73.03,58.56) 72.6,58.14 U3.41 ; R15.1 62.18,77.29 63.91,75.56 63.91,72.62 v6(64.87,71.65)
  Bottom Layer w0.305: v6(64.87,71.65) 70.31,71.65 73.03,68.93 v6(73.03,58.56)
M1_HA2: length 40.1
  Top Layer w0.254: U3.36 77.12,54.56 77.71,55.14 78.69,55.14 80.87,57.33 v6(80.87,59.26)
  Top Layer w0.305: R14.1 61.93,75.36 62.69,74.6 62.69,72.31 64.72,70.28 77.88,70.28 v6(77.98,70.18)
  Bottom Layer w0.305: v6(77.98,70.18) 78.28,69.88 78.28,63.22 80.87,60.63 v6(80.87,59.26)
M1_HB1: length 22.4
  Top Layer w0.254: U3.1 v6(68.86,54.56)
  Top Layer w0.305: R32.1 61.41,68.75 v6(60.66,68)
  Bottom Layer w0.305: v6(68.86,54.56) 69.39,55.09 69.39,57.12 68.48,58.04 64.21,58.04 60.66,61.59 v6(60.66,68)
M1_HB2: length 18.2
  Top Layer w0.254: v6(70.87,58.6) 71.1,58.36 U3.44
  Top Layer w0.305: v6(62.53,62.81) 62.53,66.57 62.08,67.02 R30.1
  Bottom Layer w0.305: v6(62.53,62.81) 62.53,62.26 64.26,60.53 68.94,60.53 v6(70.87,58.6)
M1_LA1: length 31.6
  Top Layer w0.305: v6(81.43,63.58) 81.43,63.02 78.54,60.12 77.42,60.12 76,58.7 74.92,58.7 73.6,57.39 U3.39 ; v6(77.47,78.77) 76.96,78.77 76.56,78.36 76.56,77.61 R24.1
  Bottom Layer w0.305: v6(77.47,78.77) 78.89,78.77 81.43,76.23 v6(81.43,63.58)
M1_LA2: length 28.5
  Top Layer w0.305: U3.38 74.1,57.15 75.15,58.19 76.86,58.19 77.88,59.21 78.84,59.21 82.19,62.56 82.19,67.03 81.23,68 81.23,73.84 79.63,75.44 R20.1
M1_LB1: length 27
  Top Layer w0.305: U3.47 69.6,57.12 67.62,59.11 67.62,61.8 68.48,62.66 78.74,62.66 79.91,63.83 79.91,66.62 77.88,68.66 76.42,68.66 R42.1
M1_LB2: length 25.7
  Top Layer w0.305: v6(80.57,63.98) 80.57,63.27 79.3,62 69.14,62 68.48,61.34 68.48,58.97 70.1,57.34 U3.46
  Top Layer w0.381: R39.1 77.52,66.73 78.03,66.22 v6(79.2,66.22)
  Bottom Layer w0.381: v6(80.57,63.98) 80.57,65.2 79.55,66.22 v6(79.2,66.22)
M1_SA: length 46
  Top Layer w0.305: v6(65.53,62.76) 59.13,56.36 59.13,50.11 60.2,49.05 61.66,49.05 61.71,49.1 ; v6(65.94,70.99) 67.72,72.77 70.41,72.77 70.56,72.92
  Top Layer w0.635: U8.3 70.61,76.33 69.6,75.31 69.6,73.89 70.56,72.92 75.13,72.92 R19.2 75.1,73.15 73.52,73.15 72.89,73.79 71.99,73.79
  Bottom Layer w0.381: v6(65.94,70.99) 65.94,63.17 v6(65.53,62.76)
M1_SB: length 40.8
  Top Layer w0.305: 70.56,64.14 70.05,63.63 64.82,63.63 58.32,57.12 58.32,49.05 60.1,47.27 61.71,47.27
  Top Layer w0.635: U12.1 72.76,65.05 73.37,64.44 R38.2 74.67,64.14 70.56,64.14 69.65,65.05 69.65,66.67 70.56,67.59 U12.3
M1_SRAH: length 5.2
  Top Layer w0.305: U3.8 66.12,51.06 64.16,49.1 R18.1
M1_SRAL: length 35.6
  Top Layer w0.305: v6(65.28,61.39) 65.28,60.33 62.84,57.89 61.8,57.89 59.89,55.98 59.89,51.08 60.91,50.06 64.16,50.06 65.65,51.56 U3.7 ; R23.2 61.41,72.02 63.19,70.23 v6(63.25,70.23)
  Bottom Layer w0.381: v6(65.28,61.39) 63.25,63.42 v6(63.25,70.23)
M1_SRBH: length 6.6
  Top Layer w0.305: R36.1 64.41,47.27 65.26,48.11 65.26,49.39 66.42,50.56 U3.9
M1_SRBL: length 32.4
  Top Layer w0.305: R41.2 61.41,61.48 57.3,57.38 57.3,48.29 59.28,46.3 65.23,46.3 66.07,47.15 66.07,49.38 66.75,50.06 U3.10
M1_VCC: length 27.5
  Top Layer w0.305: 77.67,47.02 77.67,48.59 77.4,48.86 77.4,50.59 76.93,51.06 U3.29
  Top Layer w0.381: v6(60.76,51.23) 61.56,51.23 61.71,51.08 ; v6(76.25,46.97) 77.62,46.97 C21.2
  Bottom Layer w0.381: v6(60.76,51.23) 60.15,50.62 60.15,48.34 61.52,46.97 v6(76.25,46.97)
M2_5VOUT: length 7
  Top Layer w0.305: U4.5 41.5,52.46 41.29,52.25 40.4,52.25 39.49,53.16 C9.1 38.61,53.05 38.61,51.64 38.1,51.13 R6.2
M2_BMA1: length 45
  Top Layer w0.305: v6(49.12,79.78) 49.12,79.78 49.12,60.09 C32.1 49.42,59.42 47.76,57.76 U4.40
  Bottom Layer w0.305: v6(49.12,79.78) 50.19,80.85 53.09,80.85 54.91,82.68 54.91,92.18 56.26,93.52 v6(58.22,93.52)
  vias: v6(58.22,94.07) v6(64.4,94.34) v6(64.76,95.05) v6(64.77,93.7)
M2_BMA2: length 43.4
  Top Layer w0.254: U4.37 49.26,56.57 49.74,57.04 50.81,57.04 51.2,57.44 C27.1
  Top Layer w0.305: C27.1 53.55,57.44 55.73,59.61 v6(55.73,61.85)
  Bottom Layer w0.305: v6(62.69,90.81) 62.38,90.5 62.38,82.22 63.5,81.1 63.5,79.78 62.23,78.51 62.23,75.06 55.73,68.56 v6(55.73,61.85)
  vias: v6(58.34,91.33) v6(58.34,90.78) v6(64.35,91.75) v6(64.71,92.46) v6(64.76,91.08)
M2_BMB1: length 42.3
  Top Layer w0.305: v6(46.79,73.48) 45.16,71.86 45.16,65.96 40.75,61.55 C40.1 40.76,57.19 43.49,57.19 43.76,56.92 U4.48
  Bottom Layer w0.305: v6(46.79,73.48) 49.07,75.77 49.07,76.99 49.89,77.8 55.27,77.8 57.71,80.24 57.71,84.32 v6(58.32,84.94)
  vias: v6(58.32,85.48) v6(64.4,85.75) v6(64.76,86.46) v6(64.76,85.14)
M2_BMB2: length 36.3
  Top Layer w0.254: C34.1 44.42,58.65 45.26,57.8 U4.45
  Top Layer w0.305: C34.1 44.42,61.16 47.45,64.19 47.45,79.73 48.92,81.2 56.08,81.2 56.87,82 U11.1
  vias: v6(58.29,82.79) v6(58.29,82.19) v6(64.4,83.11) v6(64.76,83.82) v6(64.81,82.45)
M2_CA1: length 4.7
  Top Layer w0.305: C32.2 47.5,59.79 46.76,59.05 U4.42
M2_CA2: length 5.4
  Top Layer w0.254: U4.35 49.89,53.96 49.63,54.21 49.63,55.03 50.65,56.04 C27.2
M2_CB1: length 3.1
  Top Layer w0.305: U4.2 41.19,53.96 40.75,54.4 C40.2
M2_CB2: length 4
  Top Layer w0.254: U4.43 46.26,55.91 46.26,58.74 45.82,59.19 C34.2
M2_HA1: length 52.7
  Top Layer w0.305: U4.41 47.31,55.95 47.31,58.32 v6(47.66,58.67) ; v6(48.26,79.43) 48.31,79.38 v6(48.31,61.85) ; v6(60.86,96.34) 61.06,96.34 61.41,96 R17.1
  Bottom Layer w0.305: v6(47.66,58.67) 48.31,59.32 v6(48.31,61.85) ; v6(48.26,79.43) 48.26,80.44 49.58,81.76 52.68,81.76 53.7,82.78 53.7,94.21 55.83,96.34 v6(60.86,96.34)
M2_HA2: length 51.1
  Top Layer w0.305: U4.36 51.55,54.46 52.1,55.01 53.05,55.01 57.1,59.06 v6(57.1,61.9) ; R16.1 62.11,92.91 63.35,91.67 v6(63.35,89.74)
  Bottom Layer w0.305: v6(57.1,61.9) 56.69,62.31 56.69,68.15 63.04,74.5 63.04,78.11 67.67,82.73 67.67,87.5 66.4,88.77 64.31,88.77 v6(63.35,89.74)
M2_HB1: length 42.9
  Top Layer w0.305: v6(42.32,56.11) 42.32,54.46 U4.1 ; R33.1 61.41,85.77 61.06,85.42 v6(60.91,85.42)
  Bottom Layer w0.305: v6(60.91,85.42) 59.03,83.54 59.03,79.93 54.36,75.26 54.36,65.71 52.32,63.68 47.09,63.68 43.94,60.53 43.94,57.73 v6(42.32,56.11)
M2_HB2: length 38.2
  Top Layer w0.254: U4.44 45.76,58.22 v6(45.47,58.52)
  Top Layer w0.305: R31.1 61.41,83.68 v6(61.06,83.34)
  Bottom Layer w0.305: v6(61.06,83.34) 60.55,82.83 60.55,79.93 56.44,75.82 56.44,73.25 55.07,71.88 55.07,65.1 52.78,62.81 47.45,62.81 45.47,60.83 45.47,58.52 v6(45.47,58.52)
M2_LA1: length 56.5
  Top Layer w0.254: U4.39 48.26,57.52 49.14,58.39 49.87,58.39 51.61,60.13 51.61,61.39 53.95,63.73 57.86,63.73 v6(58.01,63.88)
  Top Layer w0.305: v6(75.74,93.95) 76.32,94.53 R28.1
  Bottom Layer w0.305: v6(58.01,63.88) 58.27,63.88 58.98,64.59 58.98,68.81 63.99,73.82 63.99,77.89 66.34,80.24 71.43,80.24 73.86,82.68 73.86,92.08 v6(75.74,93.95)
M2_LA2: length 54.7
  Top Layer w0.305: v6(76.3,91.87) 76.32,91.89 R26.1 ; U4.38 48.76,57.3 49.14,57.68 50.08,57.68 55.22,62.81 58.12,62.81 v6(58.37,63.07)
  Bottom Layer w0.305: v6(76.3,91.87) 75.08,90.65 75.08,80.8 73.46,79.17 68.94,79.17 67.65,77.89 67.65,73.77 66.4,72.52 64.06,72.52 59.89,68.35 59.89,64.59 v6(58.37,63.07)
M2_LB1: length 66
  Top Layer w0.305: U4.47 44.26,57.26 42.32,59.2 42.32,62.06 45.92,65.66 45.92,71.3 v6(46.48,71.86) ; R46.1 76.36,86.18 78.33,86.18 79.4,85.12 79.4,80.49 78.33,79.43 55.52,79.43 54,77.9 54,73.18 v6(53.59,72.77)
  Bottom Layer w0.305: v6(46.48,71.86) 47.4,72.77 v6(53.59,72.77)
M2_LB2: length 58.2
  Top Layer w0.305: v6(46.69,70.69) 46.69,65.35 43.14,61.8 43.14,59.15 44.76,57.52 U4.46 ; R44.1 76.3,84.28 v6(76.3,83.39) ; v6(75.54,78.77) 56.13,78.77 54.71,77.34 54.71,72.26 54.31,71.86 v6(53.59,71.86)
  Bottom Layer w0.305: v6(53.59,71.86) 53.19,71.86 52.93,72.11 48.11,72.11 v6(46.69,70.69) ; v6(76.3,83.39) 76.3,79.53 v6(75.54,78.77)
M2_SA: length 81.4
  Top Layer w0.305: v6(54.91,79.93) 55.07,80.09 61.21,80.09 62.28,81.15 67.11,81.15 68.43,82.47 68.43,88.72 69.95,90.25 70.26,90.25 ; v6(43.54,68.86) 43.54,66.83 33.43,56.72 33.43,50.47 34.75,49.15 R21.2
  Top Layer w0.635: U9.3 70.08,93.68 69.29,92.89 69.29,91.21 70.26,90.25 74.72,90.25 R25.2 73.35,90.5 72.71,91.14 U9.1
  Bottom Layer w0.305: v6(54.91,79.93) 53.29,78.31 49.22,78.31 48.21,77.29 48.21,76.12 45.41,73.33 45.41,70.74 43.59,68.91
M2_SB: length 76.2
  Top Layer w0.305: v6(62.59,80.29) 62.64,80.34 68.88,80.34 70.05,81.51 ; R40.2 34.75,47.32 32.56,49.5 32.56,57.02 42.32,66.78 v6(42.32,66.98) ; v6(53.75,70.28) 54.56,71.09 v6(56.19,71.09)
  Top Layer w0.635: U13.3 70.33,85.04 69.34,84.05 69.34,82.22 70.05,81.51 74.57,81.51 R43.2 73.22,81.92 72.63,82.5 U13.1
  Bottom Layer w0.305: v6(42.32,66.98) 43.33,68 45.62,68 47.55,69.93 52.98,69.93 53.34,70.28 v6(53.75,70.28) ; v6(56.19,71.09) 57.1,71.09 59.33,73.33 59.33,77.04 v6(62.59,80.29)
M2_SRAH: length 5.4
  Top Layer w0.305: R21.1 37.72,49.2 39.17,49.2 40.93,50.96 U4.8
M2_SRAL: length 67.5
  Top Layer w0.305: U4.7 40.16,51.46 38.86,50.17 35.2,50.17 34.19,51.18 34.19,56.11 44.35,66.27 44.35,72.31 46.63,74.6 v6(46.63,77.29) ; R27.2 61.41,89.83 60.3,88.72 56.74,88.72 55.78,89.69 49.94,89.69 49.07,88.82 49.07,82.53 v6(47.96,81.41)
  Bottom Layer w0.305: v6(46.63,77.29) 46.63,78.31 47.09,78.77 47.09,80.54 v6(47.96,81.41)
M2_SRBH: length 6.6
  Top Layer w0.305: R40.1 39.27,47.32 40.59,48.64 40.59,49.72 41.33,50.46 U4.9
M2_SRBL: length 66.2
  Top Layer w0.305: R45.2 61.41,81.45 60.6,80.64 54.36,80.64 v6(54.05,80.34) ; U4.10 41.51,49.96 41.21,49.65 41.21,47.58 39.93,46.3 34.14,46.3 31.7,48.74 31.7,57.58 v6(41.27,67.15) 41.37,67.15
  Bottom Layer w0.305: 41.3,67.18 41.3,67.74 44.5,70.94 44.5,73.64 47.45,76.58 47.45,77.6 48.82,78.97 52.68,78.97 v6(54.05,80.34)
M2_VCC: length 28
  Top Layer w0.305: U4.29 51.56,50.96 52.03,50.49 52.03,48.51 52.32,48.21 52.32,46.89 C22.2 50.97,46.8 v6(50.95,46.81) ; R6.1 v6(35.1,51.13)
  Bottom Layer w0.305: v6(50.95,46.81) 35.66,46.81 34.49,47.98 34.49,50.52 v6(35.1,51.13)
M_VIN: length 30.2
  Top Layer w0.381: U4.33 52.5,52.96 52.88,52.58 C11.1 ; U4.4 41.05,52.96 v10(40.94,52.86) ; U3.4 65.84,53.06 v3(65.84,53.01) ; v3(80.26,52.73) C10.1 78.4,52.73 78.08,53.06 U3.33
  Top Layer w0.508: C11.1 v3(55.07,52.58) ; 32.51,80.82 32.51,77.27 30.23,74.98 27.94,74.98 27.38,74.43 R2.1
  Top Layer w0.762: C30.2 52.26,95.2 ; C37.2 52.39,69.09 ; C39.2 52.52,86.44 ; C29.2 52.64,77.47
  vias: v1(32.13,83.24) v1(32.13,82.35) v1(32.13,81.46) v1(33.02,83.24) v1(33.02,82.35) v1(33.02,81.46) v1(40.13,84.47) v1(40.13,83.09) v1(40.13,81.84) v1(41.02,84.47) v1(41.02,83.09) v1(41.02,81.84) v1(41.91,84.47) v1(41.91,83.09) v1(41.91,81.84) v1(43.49,85.52) v1(44.55,85.47) v1(50,68.33) v1(50,67.06) v1(50,65.79) v1(50.12,94.18) v1(50.12,92.91) v1(50.12,91.64) v1(50.16,85.67) v1(50.16,84.4) v1(50.16,83.13) v1(50.25,76.85) v1(50.25,75.58) v1(50.25,74.31) v1(52.41,68.35) v1(52.41,67.06) v1(52.41,65.77) v1(52.54,94.2) v1(52.54,92.91) v1(52.54,91.63) v1(52.58,85.69) v1(52.58,84.4) v1(52.58,83.12) v1(52.67,76.87) v1(52.67,75.58) v1(52.67,74.29)
M_VS: length 4.6
  Top Layer w1.27: 44.7,89.51 44.62,89.59 42.93,89.59
  Top Layer w1.524: 44.7,89.51 TV2.1
  vias: v1(41.78,90.92) v1(41.78,90.09) v1(41.78,89.27) v1(41.78,88.44) v1(42.93,90.95) v1(42.93,90.13) v1(42.93,89.3) v1(42.93,88.47)
NRST: length 7.2
  Top Layer w0.254: 42.86,21.64 42.86,22.09 42.16,22.78 39.89,22.78 38.37,24.31 U5.7
OSC_IN: length 4.4
  Top Layer w0.254: R7.2 36.58,21.66 36.58,22.53 37.37,23.32 U5.5
OSC_OUT: length 9
  Top Layer w0.254: X1.1 40.39,18.72 39.88,19.23 39.88,19.57 39.3,20.15 39.3,20.51 38.92,20.88 C13.2 38.92,22.28 37.87,23.33 U5.6
SPI1_MISO: length 35.5
  Top Layer w0.254: U5.22 44.9,30.2 49.63,30.2 50.65,31.22 51.51,31.22 58.67,38.38 58.67,39.14 59.08,39.55 v6(59.18,39.55)
  Top Layer w0.305: 61.87,38.28 63.25,38.28 70.1,45.14 U3.15
  Bottom Layer w0.305: v6(59.18,39.55) 60.1,39.55 61.37,38.28 v6(61.93,38.28)
SPI1_MOSI: length 35.6
  Top Layer w0.254: v6(57.66,38.23) 57.66,38.18 51.31,31.83 50.34,31.83 49.17,30.66 44.88,30.66 U5.23
  Top Layer w0.305: U3.16 70.6,44.72 63.25,37.36 61.21,37.36
  Bottom Layer w0.305: v6(61.26,37.36) 60.58,37.36 59.31,38.63 58.06,38.63 v6(57.66,38.23)
SPI1_NSS: length 32.4
  Top Layer w0.254: U5.20 50.43,29.17 51.05,29.79 52.22,29.79 62.08,39.65
  Top Layer w0.305: v6(63.7,41.22) 69.1,46.63 U3.13
  Bottom Layer w0.305: v6(63.7,41.22) v6(62.13,39.65)
SPI1_SCK: length 33.4
  Top Layer w0.381: U5.21 50.01,29.67 50.85,30.51 51.82,30.51 61.77,40.46 64.52,40.46 69.6,45.55 U3.14
SPI2_MISO: length 13.1
  Top Layer w0.305: v6(43.23,40.67) 43.89,41.33 43.89,44.93 44.76,45.81 U4.15 ; v6(41.4,40.31) 41.4,38.99 41.87,38.53 41.87,36.86
  Bottom Layer w0.305: v6(41.4,40.31) 41.76,40.67 v6(43.23,40.67)
SPI2_MOSI: length 14.1
  Top Layer w0.305: v6(43.49,39.8) 44.45,40.77 44.45,44.63 45.26,45.44 U4.16 ; v6(40.74,39.34) 40.74,38.89 41.37,38.26 41.37,36.86
  Bottom Layer w0.305: v6(43.49,39.8) 43.33,39.65 41.05,39.65 v6(40.74,39.34)
SPI2_NSS: length 14.7
  Top Layer w0.305: v6(42.37,42.14) 42.06,42.44 42.06,44.88 43.76,46.58 U4.13 ; v6(45.06,41.48) 45.06,40.21 42.87,38.02 42.87,36.86
  Bottom Layer w0.305: v6(45.06,41.48) 44.7,41.83 42.67,41.83 v6(42.37,42.14)
SPI2_SCK: length 11.1
  Top Layer w0.381: U4.14 44.26,46.17 43.08,44.98 43.08,41.68 42.37,40.97 42.37,37.17 U5.34
STATUS_BLUE: length 31.6
  Top Layer w0.305: R47.1 22.63,22.76 23.17,23.29 23.17,30.2 24.94,31.98 v6(26.97,31.98) ; v6(35.2,31.98) 43.03,31.98 43.23,32.18 43.69,32.18 43.7,32.17 U5.26
  Bottom Layer w0.305: v6(26.97,31.98) v6(35.2,31.98)
STATUS_RED: length 36.2
  Top Layer w0.305: v6(35.2,31.27) 43.38,31.27 43.79,31.67 U5.25 ; R55.1 21.97,16.97 22.76,17.75 22.76,21.51 23.83,22.58 23.83,29.9 25.15,31.22 v6(25.25,31.22)
  Bottom Layer w0.305: v6(35.2,31.27) 35.15,31.22 v6(25.25,31.22)
SWCLK: length 4.4
  Top Layer w0.254: U5.49 31.72,35.17 31.02,35.86 29.21,35.86
SWDIO: length 9.3
  Top Layer w0.254: U5.46 36.37,36.19 36.02,35.84 33.3,35.84 30.73,38.41 H1.2
UART1_RX: length 33
  Top Layer w0.305: U5.43 37.87,33.38 v6(38.56,32.69) ; v6(46.33,21.67) 46.33,20.6 48.77,18.16 48.77,16.08 45.57,12.88 44.53,12.88 43.56,11.91 CN6.2
  Bottom Layer w0.305: v6(46.33,21.67) 38.56,29.44 v6(38.56,32.69)
UART1_TX: length 33.7
  Top Layer w0.305: v6(47.8,17.15) 47.8,17.09 44.35,13.64 42.06,13.64 41.06,12.64 CN6.1 ; v6(40.03,32.69) 38.37,34.35 U5.42
  Bottom Layer w0.305: v6(47.8,17.15) 47.8,21.62 40.03,29.39 v6(40.03,32.69)
UART2_RX: length 23.3
  Top Layer w0.305: U5.17 45.91,27.67 47.09,26.49 50.24,26.49 55.75,20.98 55.75,11.33
UART2_TX: length 19.9
  Top Layer w0.305: U5.16 42.87,24.82 43.51,24.18 45.59,24.18 53.25,16.52 53.25,11.33
UART3_RX: length 46.5
  Top Layer w0.305: 35.15,33.45 v6(34.9,33.45) 34.68,33.67 U5.52 ; 67.69,11.43 67.69,14.43 54.31,27.81 51.46,27.81 v6(50.8,27.15)
  Bottom Layer w0.305: 34.95,33.45 40.39,33.45 40.94,32.89 40.94,32.18 43.28,29.84 46.5,29.84 49.19,27.15 v6(50.8,27.15)
UART3_TX: length 43
  Top Layer w0.305: 65.19,11.43 65.19,13.88 52.07,27 v6(52.02,27) ; U5.51 35.1,34.17
  Bottom Layer w0.305: v6(35.1,34.16) 40.49,34.16 41.66,33 41.66,32.44 43.59,30.51 47.19,30.51 49.84,27.86 51.16,27.86 v6(52.02,27)
$1N12331: length 4.4
  Top Layer w1.143: 24.38,89.51 22.73,89.51
  Top Layer w1.524: 24.38,89.51 TV1.1
  vias: v1(22.17,90.22) v1(22.17,89.4) v1(22.17,88.57) v1(23.16,90.23) v1(23.16,89.4) v1(23.16,88.58)
$1N13220: length 8.7
  Top Layer w0.762: L1.1 8.23,68.89 6.16,70.96 5.08,70.96 4.95,71.08 4.95,72.61 5.46,73.12 U1.2
$1N14900: length 2.3
  Top Layer w0.508: LED1.2 28.99,78.87 R1.2
$1N23437: length 6.8
  Top Layer w0.254: X1.2 31.49,18.97 32.76,20.24 32.76,21.58 C12.2 R7.1
$1N23917: length 5.4
  Top Layer w0.381: R22.2 78.49,13.82 79.74,12.58 79.74,10.69
$1N24094: length 2.3
  Top Layer w0.381: Q1.3 79.5,16.88 80,16.38 R22.1
$1N24137: length 6.5
  Top Layer w0.381: Q1.1 80.45,20.49 80.01,20.93 76.95,20.93 76.57,20.55 76.57,19.28 R29.1
$1N24876: length 4.3
  Top Layer w0.635: Q3.2 14.94,23.45 13.98,22.49 CN16.1
$1N25138: length 3.9
  Top Layer w0.635: Q7.2 15.54,17.49 CN16.3
$1N25168: length 5.5
  Top Layer w0.508: Q2.3 12.73,48.82 12.19,48.29 10.21,48.29 CN12.2
$1N25428: length 5.5
  Top Layer w0.508: CN15.2 10.21,57.43 11.79,57.43 12.32,57.96 Q6.3
$1N25552: length 5.1
  Top Layer w0.508: R47.2 20.52,21.93 20.52,21.41 21.11,20.83 R48.2
  Top Layer w0.635: Q3.1 17.6,23.39 17.98,23.39 18.62,22.76 R47.2
$1N25560: length 5
  Top Layer w0.508: R55.2 19.69,16.81 20.42,16.08 20.42,15.82 R53.1
  Top Layer w0.635: Q7.1 18.43,17.59 19.05,16.97 R55.2
$1N28030: length 7.1
  Top Layer w0.305: U4.21 47.76,45.73 48.87,44.63 R12.2 48.88,44.12 49.68,44.12 49.94,43.87 49.94,42.9 50.22,42.62 R13.1
$1N28152: length 7
  Top Layer w0.254: U3.21 73.1,45.54 74.15,44.5 74.15,44.13
  Top Layer w0.305: R11.1 75.56,42.62 75.18,43 75.18,43.81 74.83,44.17 74.27,44.17 R10.2
$1N28672: length 4.9
  Top Layer w0.305: C14.1 78.61,49.23 77.96,49.88 77.96,51.1 77,52.06 U3.31
$1N28681: length 4
  Top Layer w0.305: U3.32 77.51,52.56 79.07,51 C14.2
$1N28690: length 4.9
  Top Layer w0.254: U4.31 51.67,51.96 52.58,51.05 52.58,49.63 53.09,49.12 53.56,49.12 C15.1
$1N28997: length 4.8
  Top Layer w0.305: C6.1 64.04,54.86 64.52,54.38 65.53,54.38 66.36,53.56 U3.3
$1N29274: length 5
  Top Layer w0.305: U4.3 42.31,53.47 40.74,53.47 39.73,54.48 38.96,54.48 38.54,54.91 C7.1
$1N31689: length 3.3
  Top Layer w0.305: U3.34 77.93,53.56 78.5,54.13 C10.2
$1N31727: length 4
  Top Layer w0.254: C15.2 53.6,50.95 52.09,52.46 U4.32
$1N31732: length 3.1
  Top Layer w0.305: U4.34 52.51,53.46 53.03,53.98 C11.2
$1N32608: length 3.1
  Top Layer w0.635: U6.2 58.81,74.93 59.24,75.36 R14.2
$1N32656: length 3.2
  Top Layer w0.508: U6.4 57.23,77.7 59.5,77.7 R15.2
$1N33019: length 3.2
  Top Layer w0.635: R16.2 59.34,92.91 58.84,92.41 U7.2
$1N33022: length 3.3
  Top Layer w0.635: R17.2 59.56,95.25 57.18,95.25 U7.4
$1N33512: length 2.5
  Top Layer w0.508: R2.2 28.94,73.69 LED2.2
$1N33697: length 3.2
  Top Layer w0.381: U8.2 73.82,75.06 74.2,75.44 R20.2
$1N33699: length 3.1
  Top Layer w0.381: U8.4 R24.2
$1N34248: length 3.4
  Top Layer w0.635: U10.2 58.92,66.55 59.39,67.02 R30.2
$1N34253: length 3.4
  Top Layer w0.635: R32.2 59.56,69.39 57.05,69.39 U10.4
$1N34300: length 3.1
  Top Layer w0.381: R39.2 73.91,66.73 73.51,66.32 U12.2
$1N34302: length 3
  Top Layer w0.381: U12.4 74.71,68.86 R42.2
$1N35035: length 3.3
  Top Layer w0.635: U9.2 73.44,92.41 73.95,92.91 R26.2
$1N35037: length 3.1
  Top Layer w0.635: 74.81,94.82 74.68,94.95 U9.4
$1N35064: length 3.2
  Top Layer w0.635: R31.2 59.29,84.3 58.77,83.77 U11.2
$1N35069: length 3.4
  Top Layer w0.635: U11.4 57.28,86.72 59.46,86.72 R33.2
$1N35116: length 3.3
  Top Layer w0.635: R44.2 73.78,84.3 73.25,83.77 U13.2
$1N35118: length 3.1
  Top Layer w0.635: 74.77,86.21 74.67,86.31 U13.4
$1N40105: length 7.2
  Top Layer w0.508: R56.2 18.64,61.14 19.69,60.09 R54.2 19,58.72 18.54,58.26 18.54,57.48 18.07,57.01 Q6.1
$1N40144: length 7.1
  Top Layer w0.508: R35.2 18.58,51.99 19.69,50.89 R34.2 19,49.57 18.54,49.11 18.54,48.44 17.97,47.87 Q2.1
$1N44076: length 6.1
  Top Layer w0.635: Q3.3 16.59,24.33 16.94,24.69 R37.1
$1N44149: length 6.3
  Top Layer w0.635: R57.2 19.67,18.92 17.07,18.92 16.59,18.44 16.59,15.49
$1N44323: length 5.5
  Top Layer w0.508: Q5.3 12.5,30.15 11.92,29.58 CN14.2
$1N44344: length 7.5
  Top Layer w0.508: Q5.1 18.25,29.2 18.54,29.49 18.54,30.61 18.85,30.91 19.68,30.91 R50.2 19.69,32.35 18.58,33.45 R52.2
$1N56880: length 7.2
  Top Layer w0.508: R51.2 18.64,42.85 19.69,41.8 R49.2 18.95,40.3 18.44,39.79 18.44,39.09 18.07,38.72 Q4.1
$1N57216: length 3.8
  Top Layer w0.508: R59.2 R58.2 79.47,40.72 Q8.1
$1N57231: length 8.4
  Top Layer w0.508: Q8.3 81.78,44.46 85.43,48.11 87.26,48.11
$1N61363: length 5.5
  Top Layer w0.508: Q4.3 12.65,39.67 12.03,39.06 CN13.2
$2N566: length 13
  Top Layer w0.305: CN2.1 18.44,6.52 14.43,2.51 12.95,2.51 ; 12.95,2.51 12.78,2.68 U14.7 ; 12.95,2.51 13,2.46
$2N570: length 18.2
  Top Layer w0.305: 11.39,4.84 R60.1 11.39,1.69 11.84,1.25 15.34,1.25 20.94,6.84 CN2.2

## Copper pours and planes (outline as drawn; the poured copper is in the pictures)
3V3 on Top Layer: 29.34,27 30.73,27 30.73,25.82 29.34,25.82
3V3 on 电源层: 27.77,42.38 29.61,42.38 29.61,40.54 27.77,40.54
3V3 on 电源层: 76.83,11.01 78.36,11.01 78.36,9.48 76.83,9.48
3V3 on 电源层: 27.77,41.35 29.61,41.35 29.61,39.51 27.77,39.51
3V3 on 电源层: 28.21,12.7 29.84,12.7 29.84,11.08 28.21,11.08
3V3 on 电源层: 27.39,12.7 29.02,12.7 29.02,11.08 27.39,11.08
3V3 on 电源层: 84.5,31.77 86.13,31.77 86.13,30.15 84.5,30.15
3V3 on 电源层: 13.32,69 87.36,69 87.36,7.96 13.32,7.96
3V3 on 电源层: 76.83,10.28 78.36,10.28 78.36,8.76 76.83,8.76
3V3 on 电源层: 84.5,32.59 86.13,32.59 86.13,30.97 84.5,30.97
3V3 on 电源层: 85.32,31.77 86.95,31.77 86.95,30.15 85.32,30.15
3V3 on 电源层: 28.21,11.88 29.84,11.88 29.84,10.26 28.21,10.26
3V3 on 电源层: 84.5,17.28 86.13,17.28 86.13,15.65 84.5,15.65
3V3 on 电源层: 28.81,41.35 30.65,41.35 30.65,39.51 28.81,39.51
3V3 on 电源层: 76.11,11.01 77.64,11.01 77.64,9.48 76.11,9.48
3V3 on 电源层: 28.81,42.38 30.65,42.38 30.65,40.54 28.81,40.54
3V3 on 电源层: 85.32,18.1 86.95,18.1 86.95,16.47 85.32,16.47
3V3 on 电源层: 84.5,18.1 86.13,18.1 86.13,16.47 84.5,16.47
3V3 on 电源层: 27.39,11.88 29.02,11.88 29.02,10.26 27.39,10.26
3V3 on 电源层: 76.11,10.28 77.64,10.28 77.64,8.76 76.11,8.76
3V3 on 电源层: 85.32,32.59 86.95,32.59 86.95,30.97 85.32,30.97
3V3 on 电源层: 85.32,17.28 86.95,17.28 86.95,15.65 85.32,15.65
5V on Top Layer: 6.15,76.23 8.33,76.23 8.33,72.11 6.15,72.11
5V on 电源层: 9.04,41.96 10.56,41.96 10.56,40.44 9.04,40.44
5V on 电源层: 17.77,69.67 19.33,69.67 19.33,68.11 17.77,68.11
5V on 电源层: 18.52,69.67 20.07,69.67 20.07,68.11 18.52,68.11
5V on 电源层: 9.76,32.48 11.28,32.48 11.28,30.95 9.76,30.95
5V on 电源层: 18.52,70.42 20.07,70.42 20.07,68.86 18.52,68.86
5V on 电源层: 9.04,60.38 10.56,60.38 10.56,58.85 9.04,58.85
5V on 电源层: 17.77,70.42 19.33,70.42 19.33,68.86 17.77,68.86
5V on 电源层: 9.04,32.48 10.56,32.48 10.56,30.95 9.04,30.95
5V on 电源层: 9.04,42.68 10.56,42.68 10.56,41.16 9.04,41.16
5V on 电源层: 9.04,61.1 10.56,61.1 10.56,59.57 9.04,59.57
5V on 电源层: 9.76,61.1 11.28,61.1 11.28,59.57 9.76,59.57
5V on 电源层: 9.76,42.68 11.28,42.68 11.28,41.16 9.76,41.16
5V on 电源层: 9.04,33.2 10.56,33.2 10.56,31.67 9.04,31.67
5V on 电源层: 9.76,33.2 11.28,33.2 11.28,31.67 9.76,31.67
5V on 电源层: 6.16,76.37 88.63,76.37 88.63,11.06 6.16,11.06
5V on 电源层: 9.76,41.96 11.28,41.96 11.28,40.44 9.76,40.44
5V on 电源层: 9.76,60.38 11.28,60.38 11.28,58.85 9.76,58.85
DGND on Top Layer: 27.18,24.31 44.81,24.31 44.81,14.45 27.18,14.45
DGND on 地层: 28.81,33.73 30.4,33.73 30.4,32.14 28.81,32.14
DGND on 地层: 45.66,12.7 47.28,12.7 47.28,11.08 45.66,11.08
DGND on 地层: 85.32,25.6 86.95,25.6 86.95,23.97 85.32,23.97
DGND on 地层: 28.02,34.51 29.61,34.51 29.61,32.92 28.02,32.92
DGND on 地层: 44.84,11.88 46.46,11.88 46.46,10.26 44.84,10.26
DGND on 地层: 85.32,39.27 86.95,39.27 86.95,37.65 85.32,37.65
DGND on 地层: 69.79,12.7 71.41,12.7 71.41,11.08 69.79,11.08
DGND on 地层: 33.21,11.88 34.84,11.88 34.84,10.26 33.21,10.26
DGND on 地层: 57.03,12.7 58.66,12.7 58.66,11.08 57.03,11.08
DGND on 地层: 45.66,11.88 47.28,11.88 47.28,10.26 45.66,10.26
DGND on 地层: 33.21,12.7 34.84,12.7 34.84,11.08 33.21,11.08
DGND on 地层: 28.02,33.73 29.61,33.73 29.61,32.14 28.02,32.14
DGND on 地层: 44.84,12.7 46.46,12.7 46.46,11.08 44.84,11.08
DGND on 地层: 84.5,39.27 86.13,39.27 86.13,37.65 84.5,37.65
DGND on 地层: 85.32,24.78 86.95,24.78 86.95,23.15 85.32,23.15
DGND on 地层: 57.03,11.88 58.66,11.88 58.66,10.26 57.03,10.26
DGND on 地层: 85.32,40.09 86.95,40.09 86.95,38.47 85.32,38.47
DGND on 地层: 57.85,12.7 59.48,12.7 59.48,11.08 57.85,11.08
DGND on 地层: 28.81,34.51 30.4,34.51 30.4,32.92 28.81,32.92
DGND on 地层: 57.85,11.88 59.48,11.88 59.48,10.26 57.85,10.26
DGND on 地层: 0.26,62.09 96.94,62.09 96.94,0.26 0.26,0.26
DGND on 地层: 69.79,11.88 71.41,11.88 71.41,10.26 69.79,10.26
DGND on 地层: 84.5,24.78 86.13,24.78 86.13,23.15 84.5,23.15
DGND on 地层: 32.39,12.7 34.02,12.7 34.02,11.08 32.39,11.08
DGND on 地层: 68.97,11.88 70.59,11.88 70.59,10.26 68.97,10.26
DGND on 地层: 68.97,12.7 70.59,12.7 70.59,11.08 68.97,11.08
DGND on 地层: 84.5,25.6 86.13,25.6 86.13,23.97 84.5,23.97
DGND on 地层: 84.5,40.09 86.13,40.09 86.13,38.47 84.5,38.47
DGND on 地层: 32.39,11.88 34.02,11.88 34.02,10.26 32.39,10.26
PGND on 地层: 16.64,90.19 18.26,90.19 18.26,88.57 16.64,88.57
PGND on 地层: 10.01,89.11 11.64,89.11 11.64,87.49 10.01,87.49
PGND on 地层: 34.57,89.79 36.2,89.79 36.2,88.17 34.57,88.17
PGND on 地层: 34.57,88.97 36.2,88.97 36.2,87.35 34.57,87.35
PGND on 地层: 20.31,69.67 21.87,69.67 21.87,68.11 20.31,68.11
PGND on 地层: 35.39,88.97 37.02,88.97 37.02,87.35 35.39,87.35
PGND on 地层: 10.01,86.1 11.64,86.1 11.64,84.47 10.01,84.47
PGND on 地层: 16.88,76.07 18.44,76.07 18.44,74.52 16.88,74.52
PGND on 地层: 11.36,20.39 12.98,20.39 12.98,18.77 11.36,18.77
PGND on 地层: 13.62,91.01 15.24,91.01 15.24,89.39 13.62,89.39
PGND on 地层: 16.88,76.82 18.44,76.82 18.44,75.27 16.88,75.27
PGND on 地层: 29.57,89.79 31.2,89.79 31.2,88.17 29.57,88.17
PGND on 地层: 40.45,72.08 42.01,72.08 42.01,70.53 40.45,70.53
PGND on 地层: 10.54,20.39 12.16,20.39 12.16,18.77 10.54,18.77
PGND on 地层: 30.39,89.79 32.02,89.79 32.02,88.17 30.39,88.17
PGND on 地层: 41.2,72.08 42.76,72.08 42.76,70.53 41.2,70.53
PGND on 地层: 16.64,91.01 18.26,91.01 18.26,89.39 16.64,89.39
PGND on 地层: 11.36,21.21 12.98,21.21 12.98,19.59 11.36,19.59
PGND on 地层: 17.63,76.07 19.19,76.07 19.19,74.52 17.63,74.52
PGND on 地层: 21.06,69.67 22.61,69.67 22.61,68.11 21.06,68.11
PGND on 地层: 20.31,70.42 21.87,70.42 21.87,68.86 20.31,68.86
PGND on 地层: 0.26,99.74 96.94,99.74 96.94,12.43 0.26,12.43
PGND on 地层: 35.39,89.79 37.02,89.79 37.02,88.17 35.39,88.17
PGND on 地层: 41.2,72.83 42.76,72.83 42.76,71.28 41.2,71.28
PGND on 地层: 40.45,72.83 42.01,72.83 42.01,71.28 40.45,71.28
PGND on 地层: 10.54,21.21 12.16,21.21 12.16,19.59 10.54,19.59
PGND on 地层: 13.62,90.19 15.24,90.19 15.24,88.57 13.62,88.57
PGND on 地层: 10.83,86.1 12.46,86.1 12.46,84.47 10.83,84.47
PGND on 地层: 30.39,88.97 32.02,88.97 32.02,87.35 30.39,87.35
PGND on 地层: 29.57,88.97 31.2,88.97 31.2,87.35 29.57,87.35
PGND on 地层: 10.84,89.11 12.46,89.11 12.46,87.49 10.84,87.49
PGND on 地层: 21.06,70.42 22.61,70.42 22.61,68.86 21.06,68.86
PGND on 地层: 17.63,76.82 19.19,76.82 19.19,75.27 17.63,75.27
VIN on Top Layer: 2.92,78.03 4.7,78.03 4.7,73.84 2.92,73.84
VIN on Top Layer: 22.86,86.28 26.16,86.28 26.16,84.25 22.86,84.25
VIN on Top Layer: 24.89,83.87 27.18,83.87 27.18,80.7 24.89,80.7
VIN on 电源层: 16.88,79.57 18.44,79.57 18.44,78.02 16.88,78.02
VIN on 电源层: 16.88,80.32 18.44,80.32 18.44,78.77 16.88,78.77
